# EAGLE design 526_AI_BLOCKS_Rev020003 (EAGLE 9.6.2)
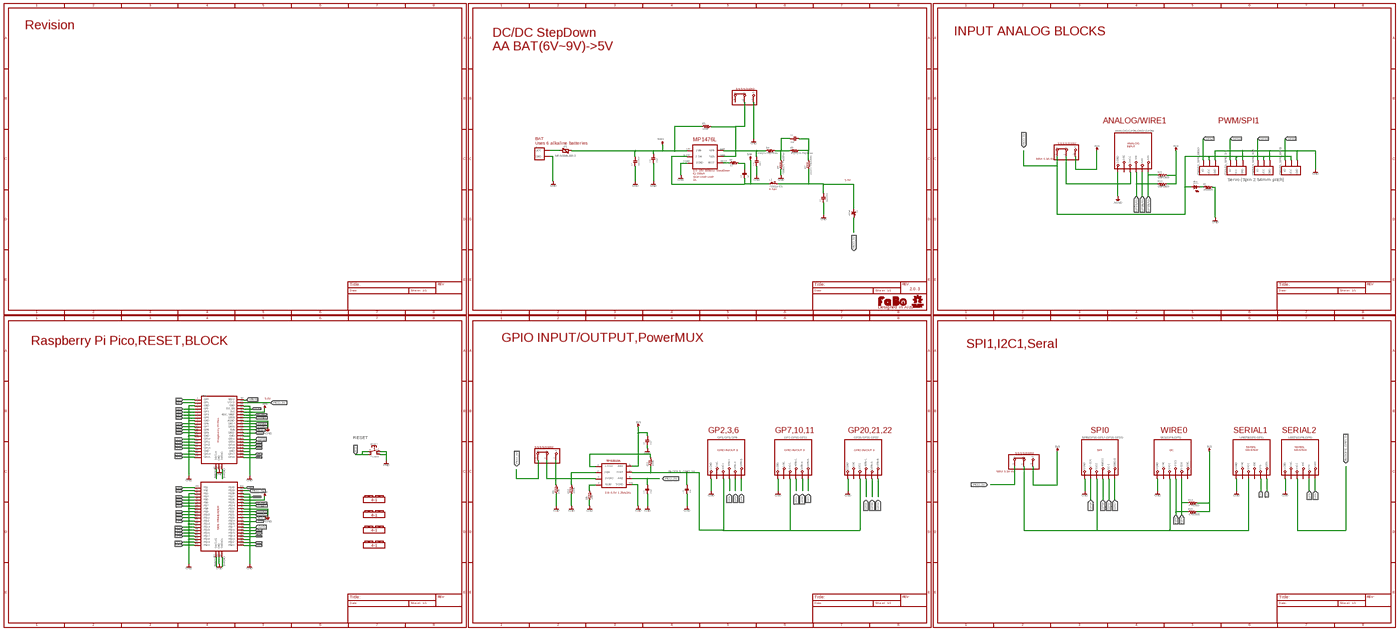
[diagram p0: schematic, sheet 1, overview]
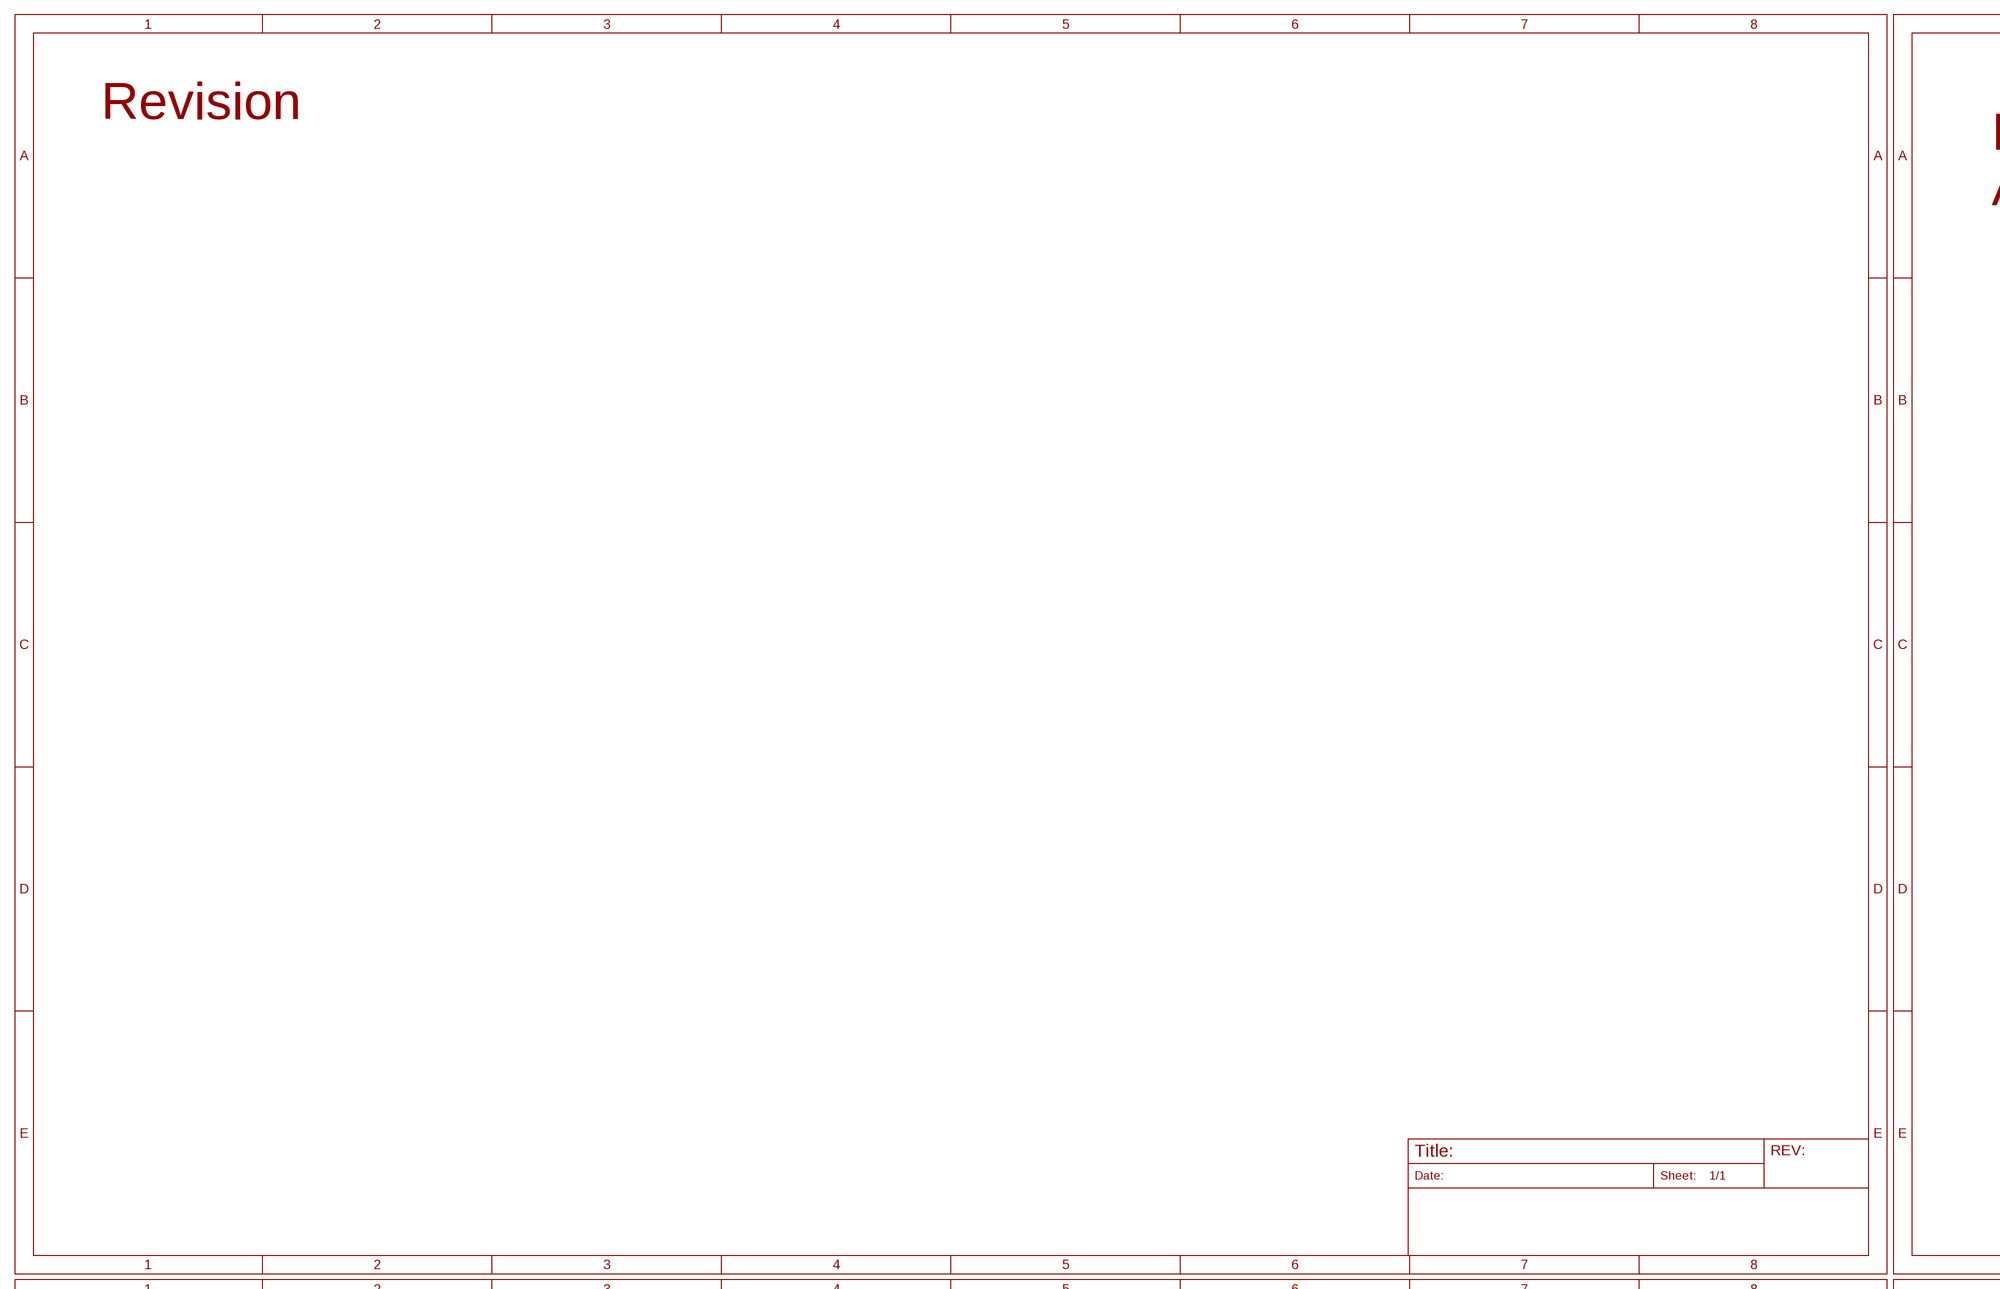
[diagram p1: schematic, sheet 1, part 1 of 6]
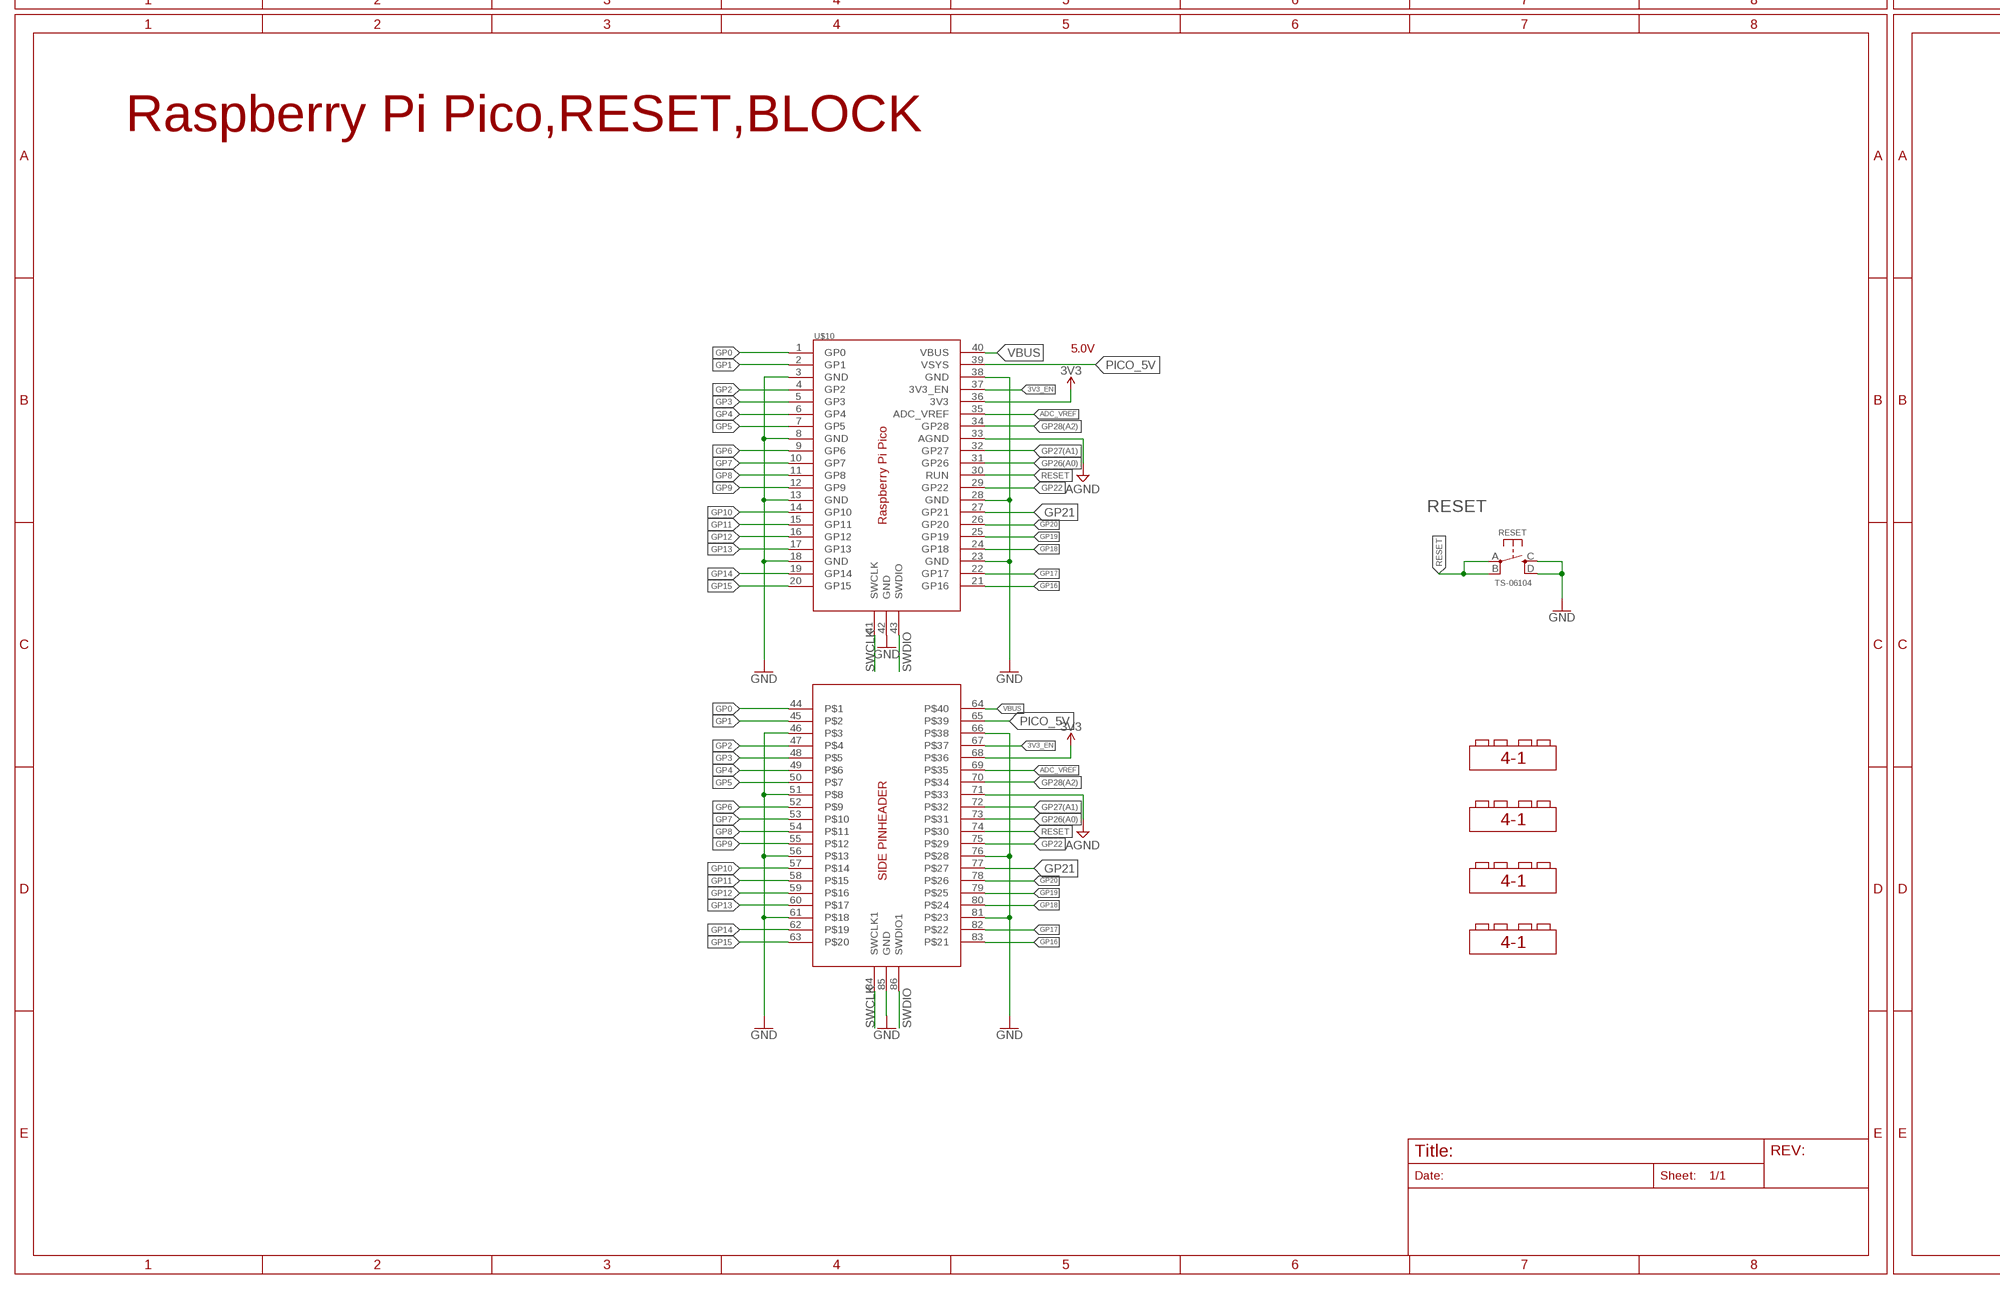
[diagram p2: schematic, sheet 1, part 2 of 6]
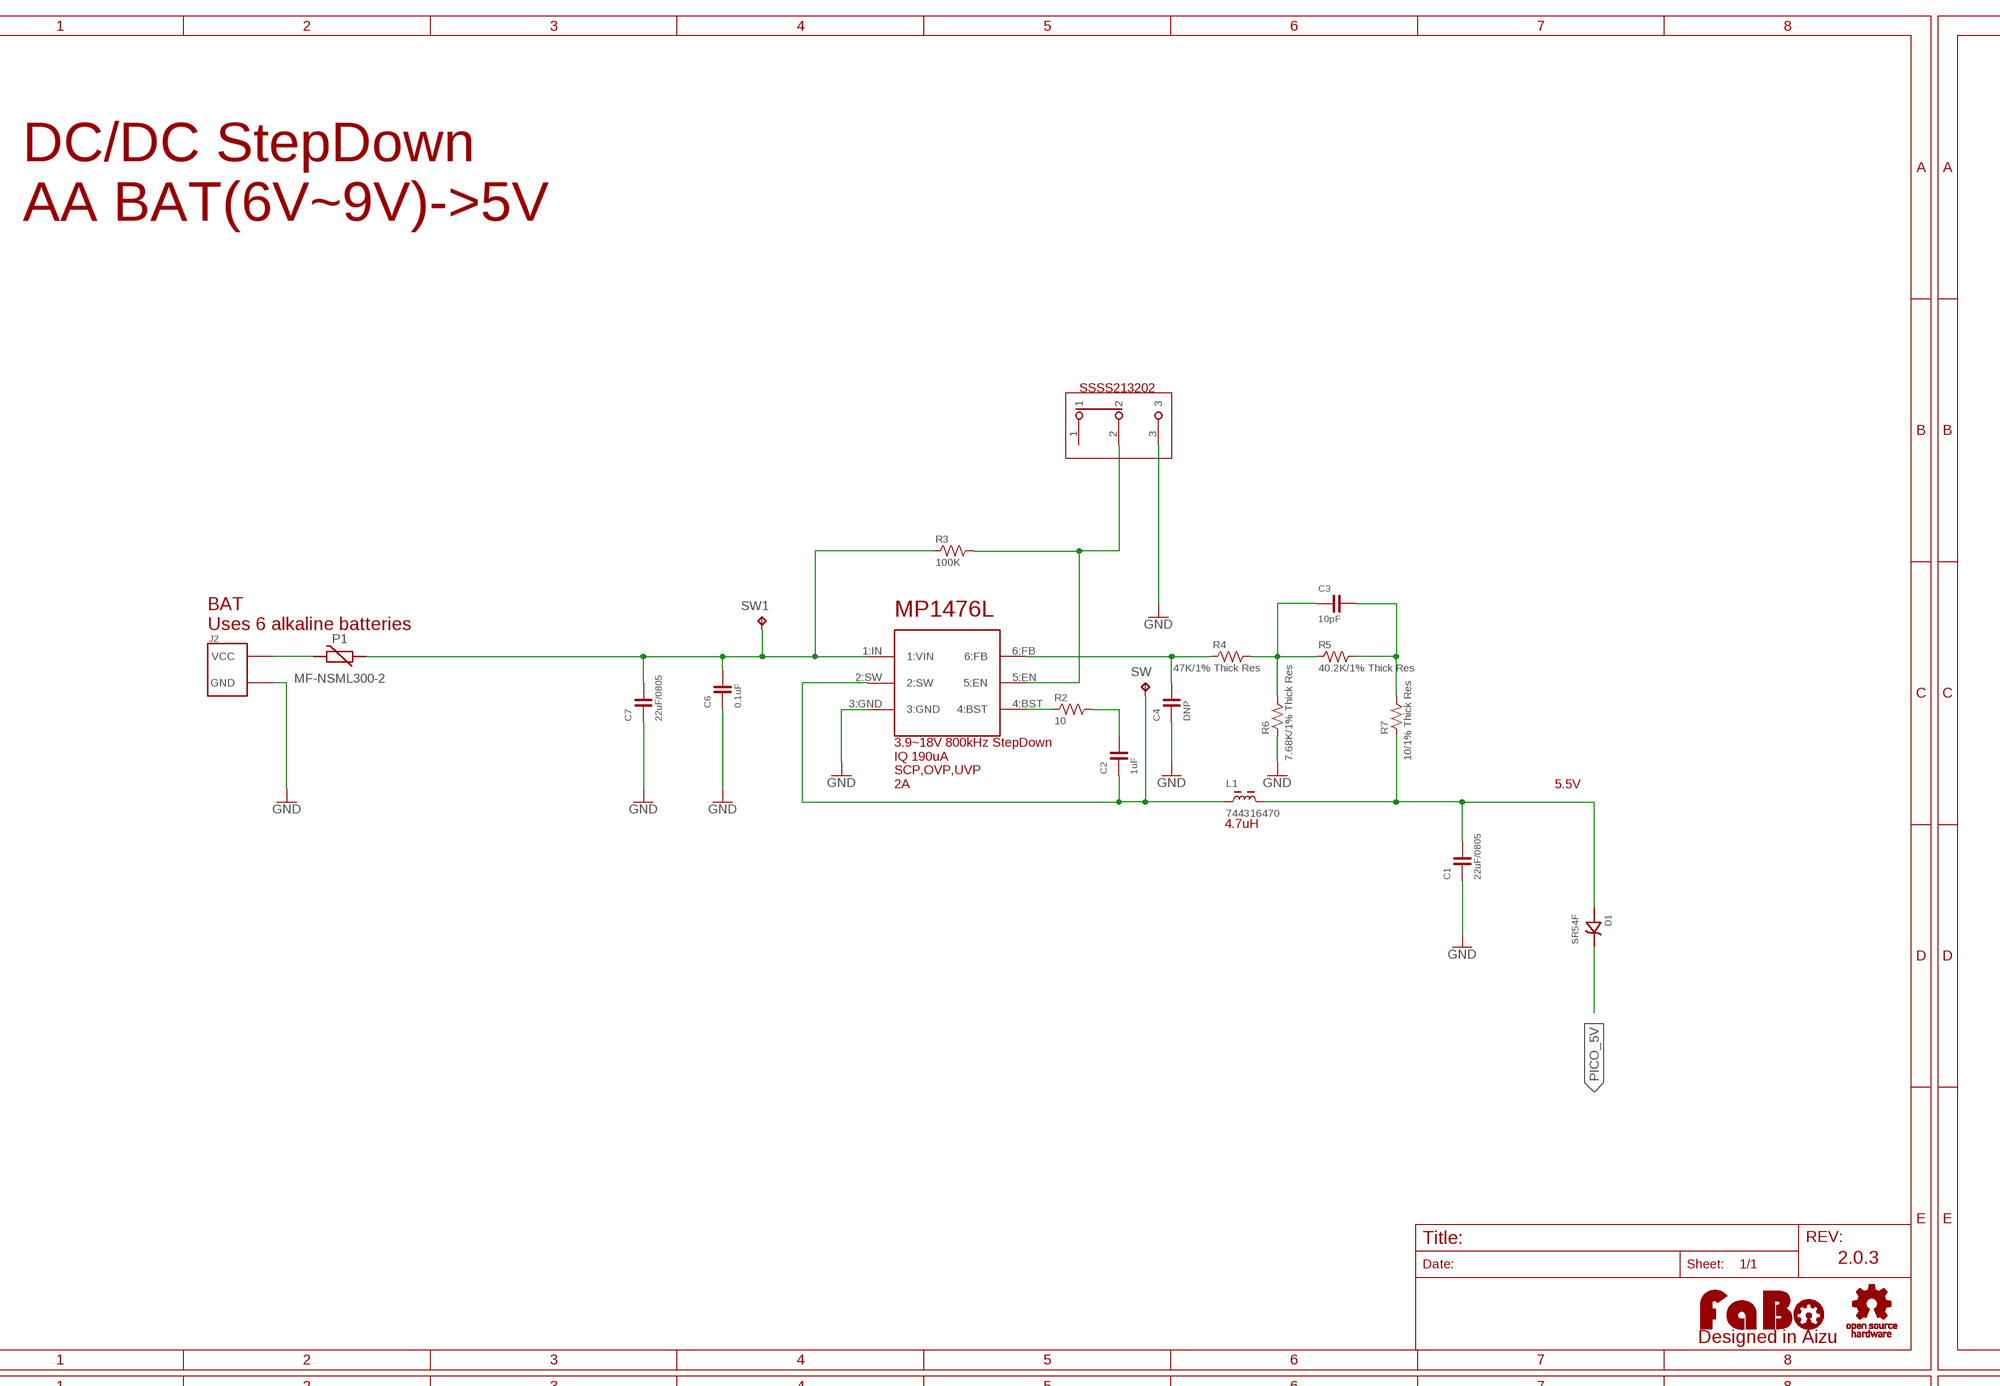
[diagram p3: schematic, sheet 1, part 3 of 6]
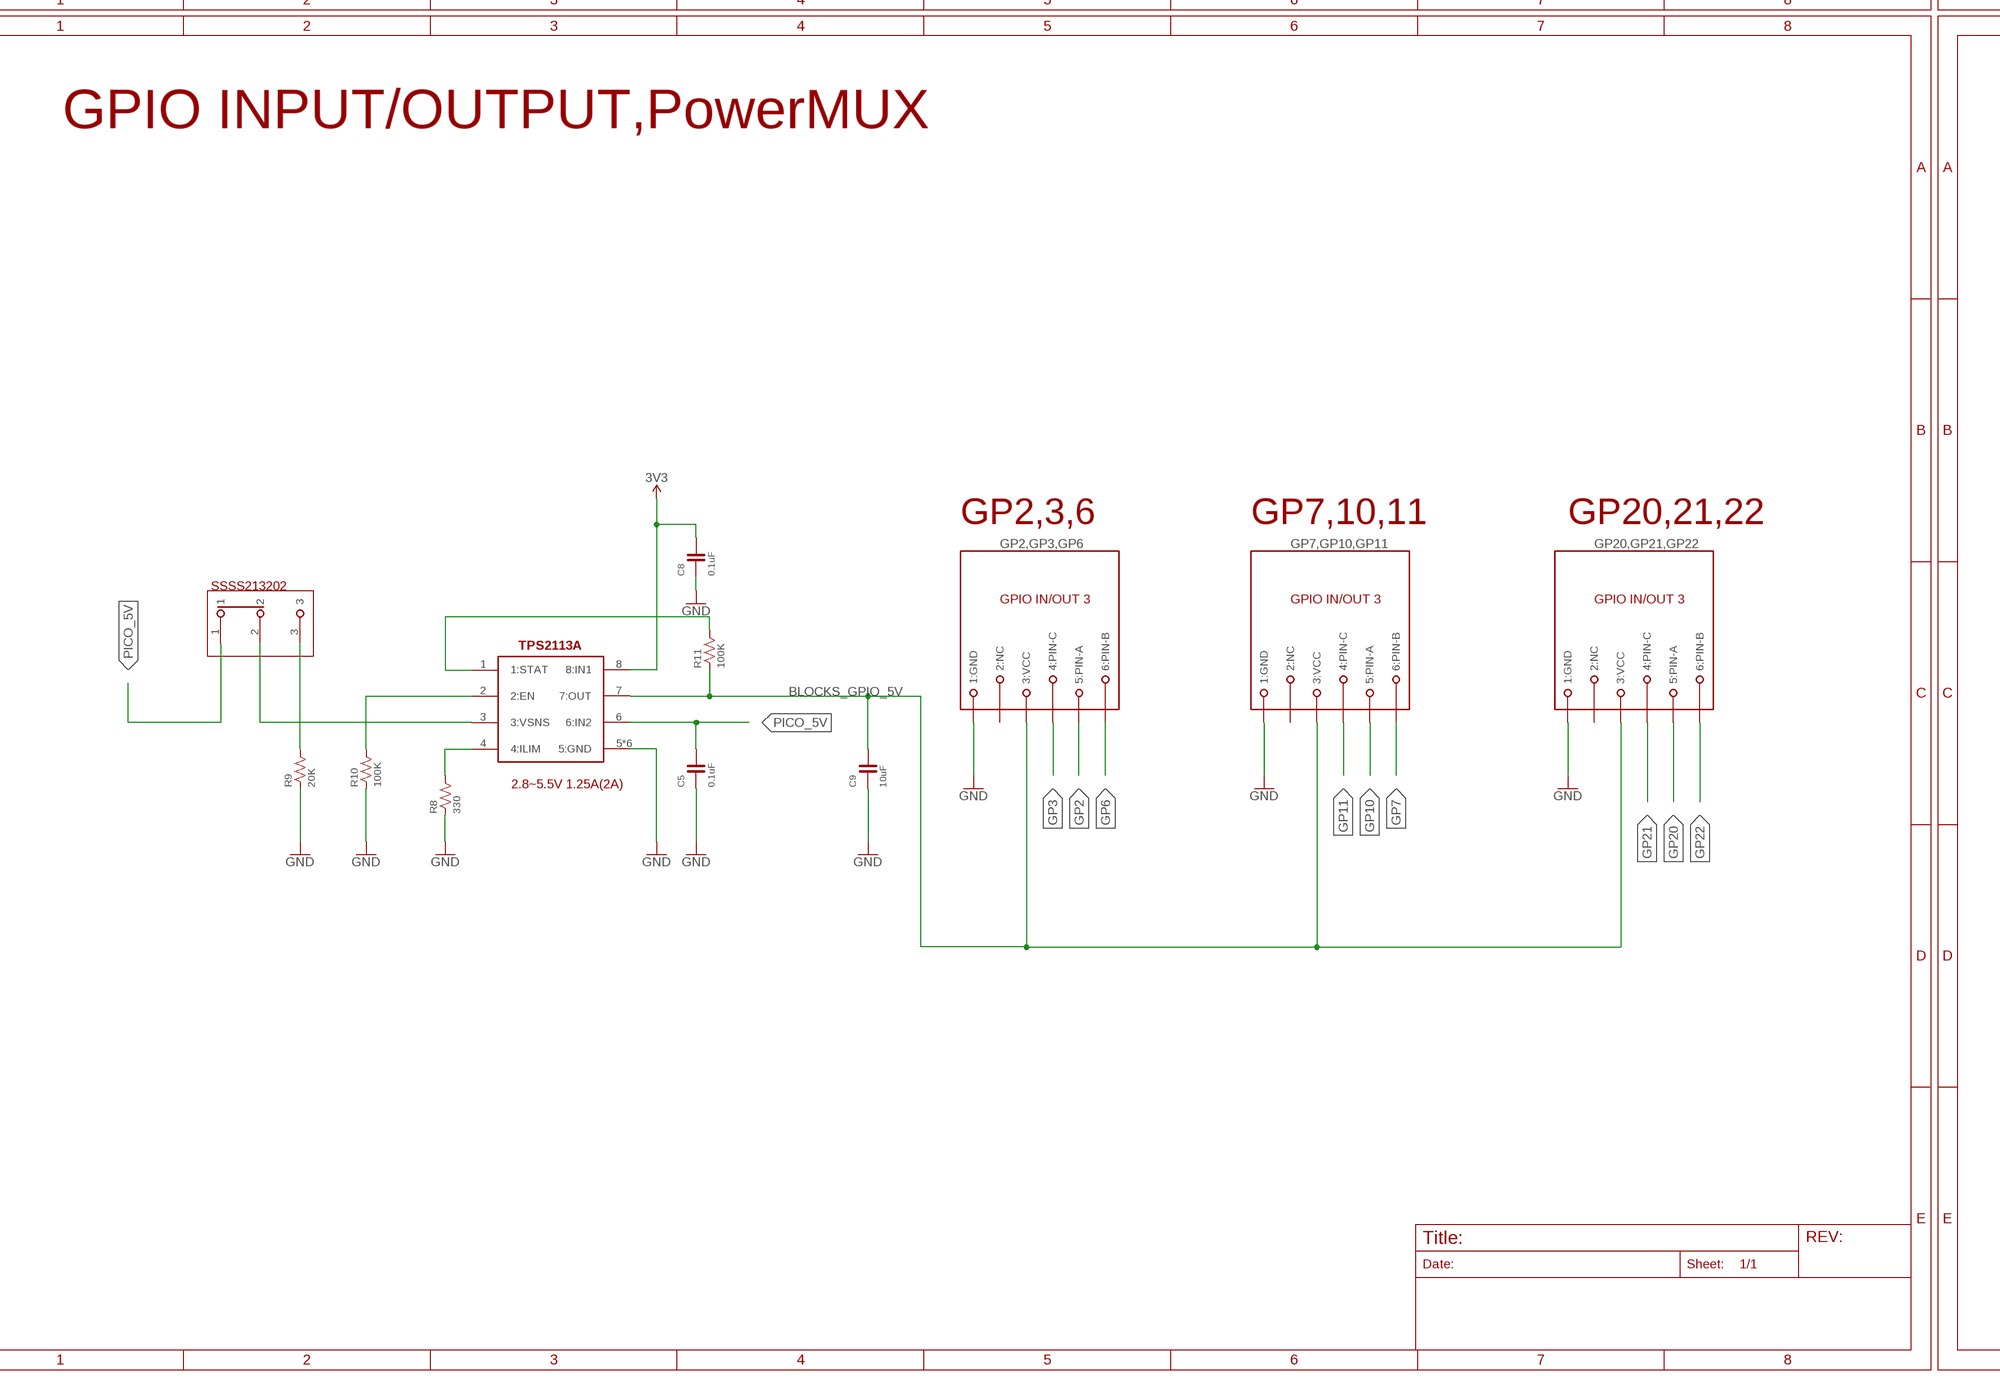
[diagram p4: schematic, sheet 1, part 4 of 6]
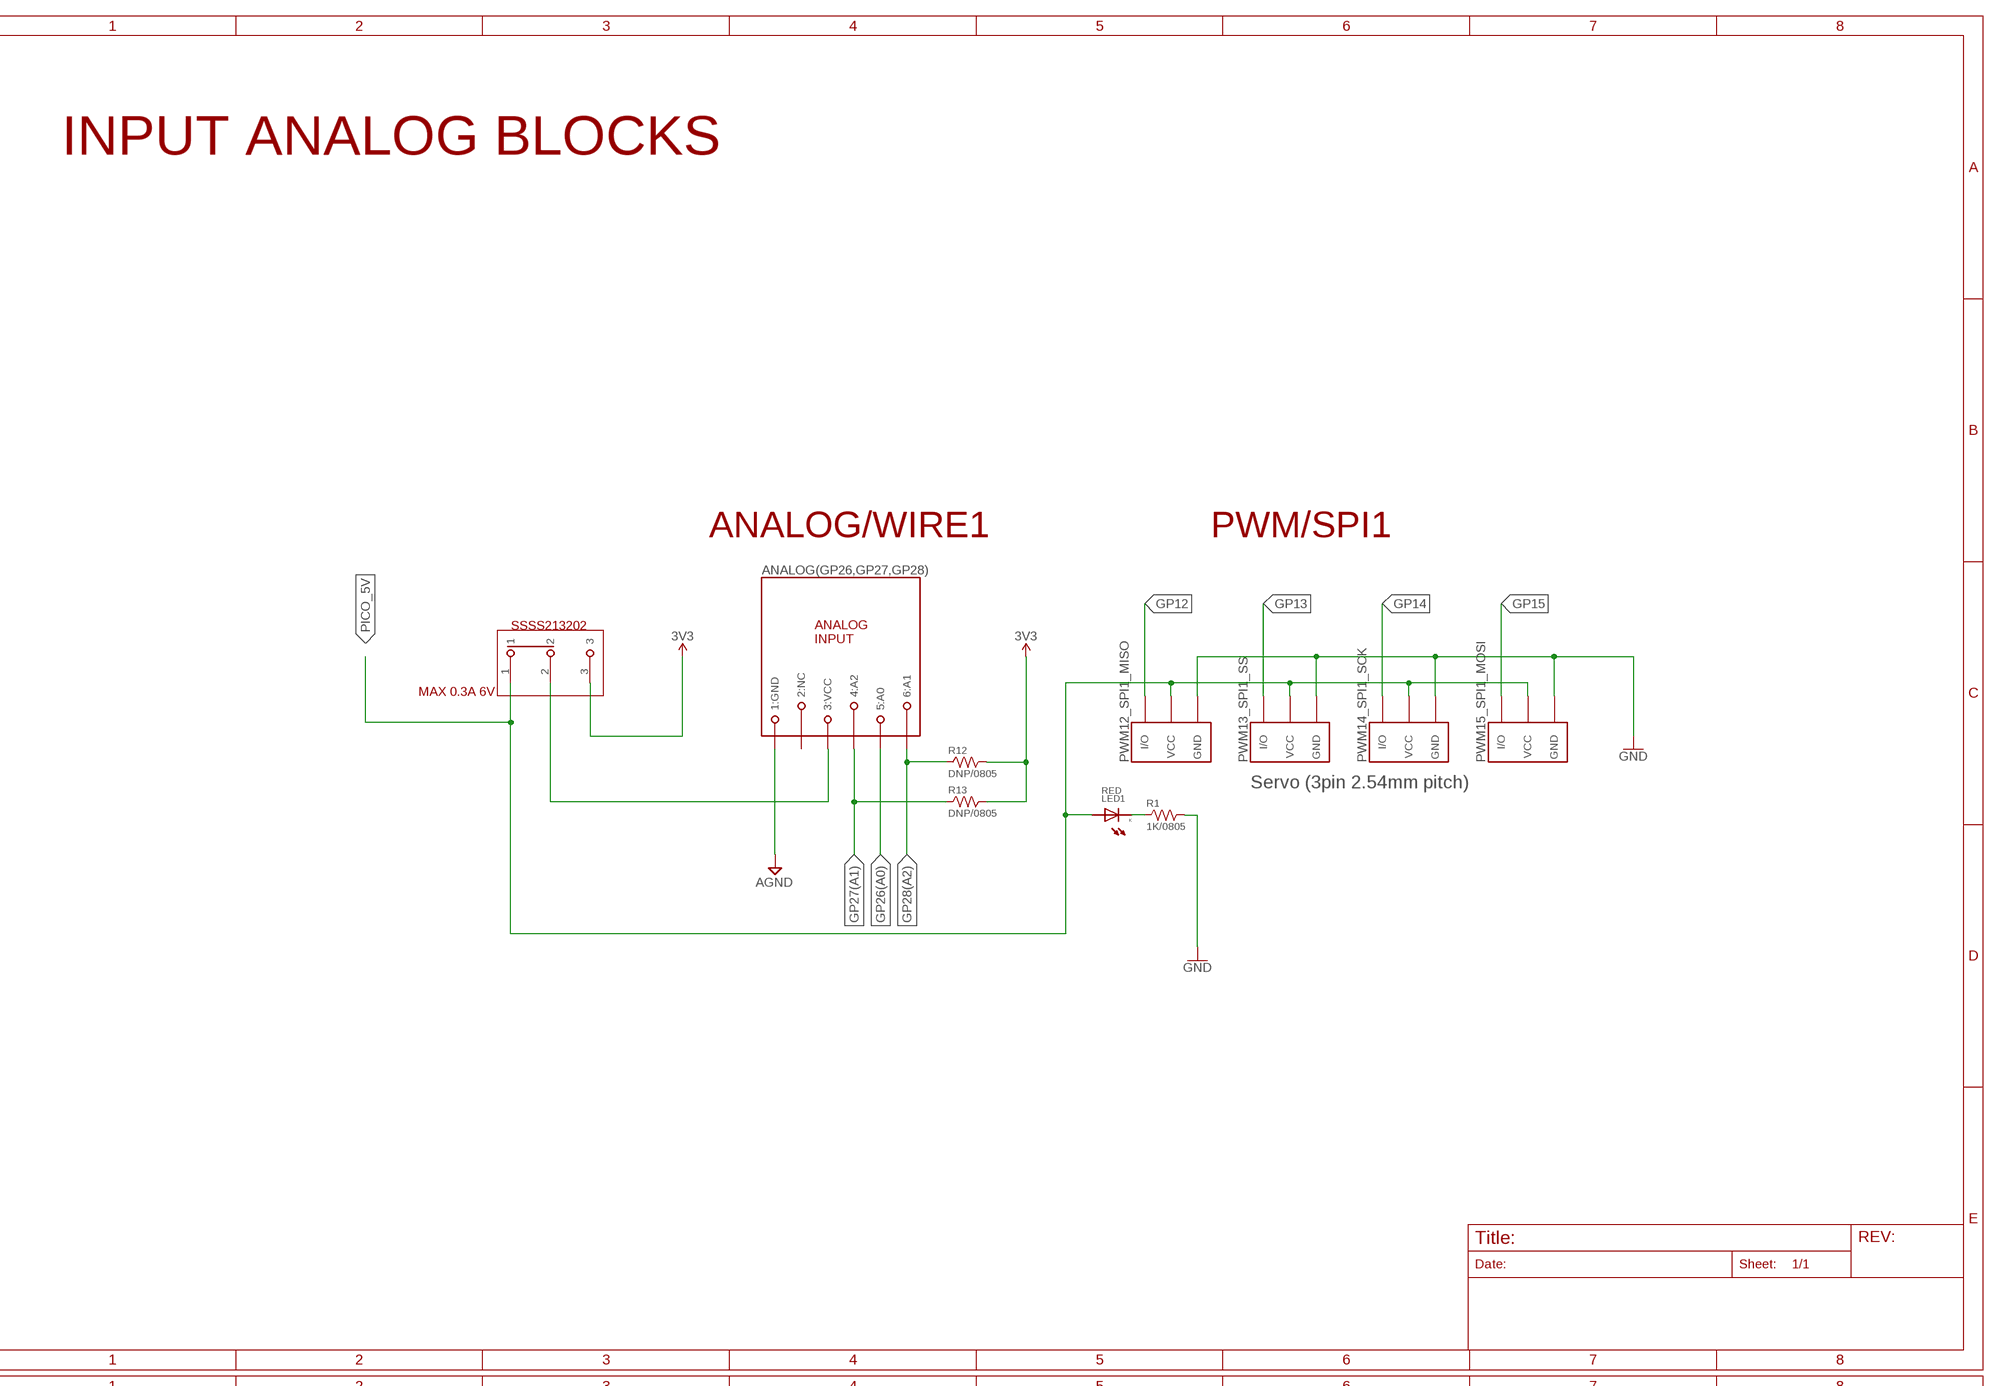
[diagram p5: schematic, sheet 1, part 5 of 6]
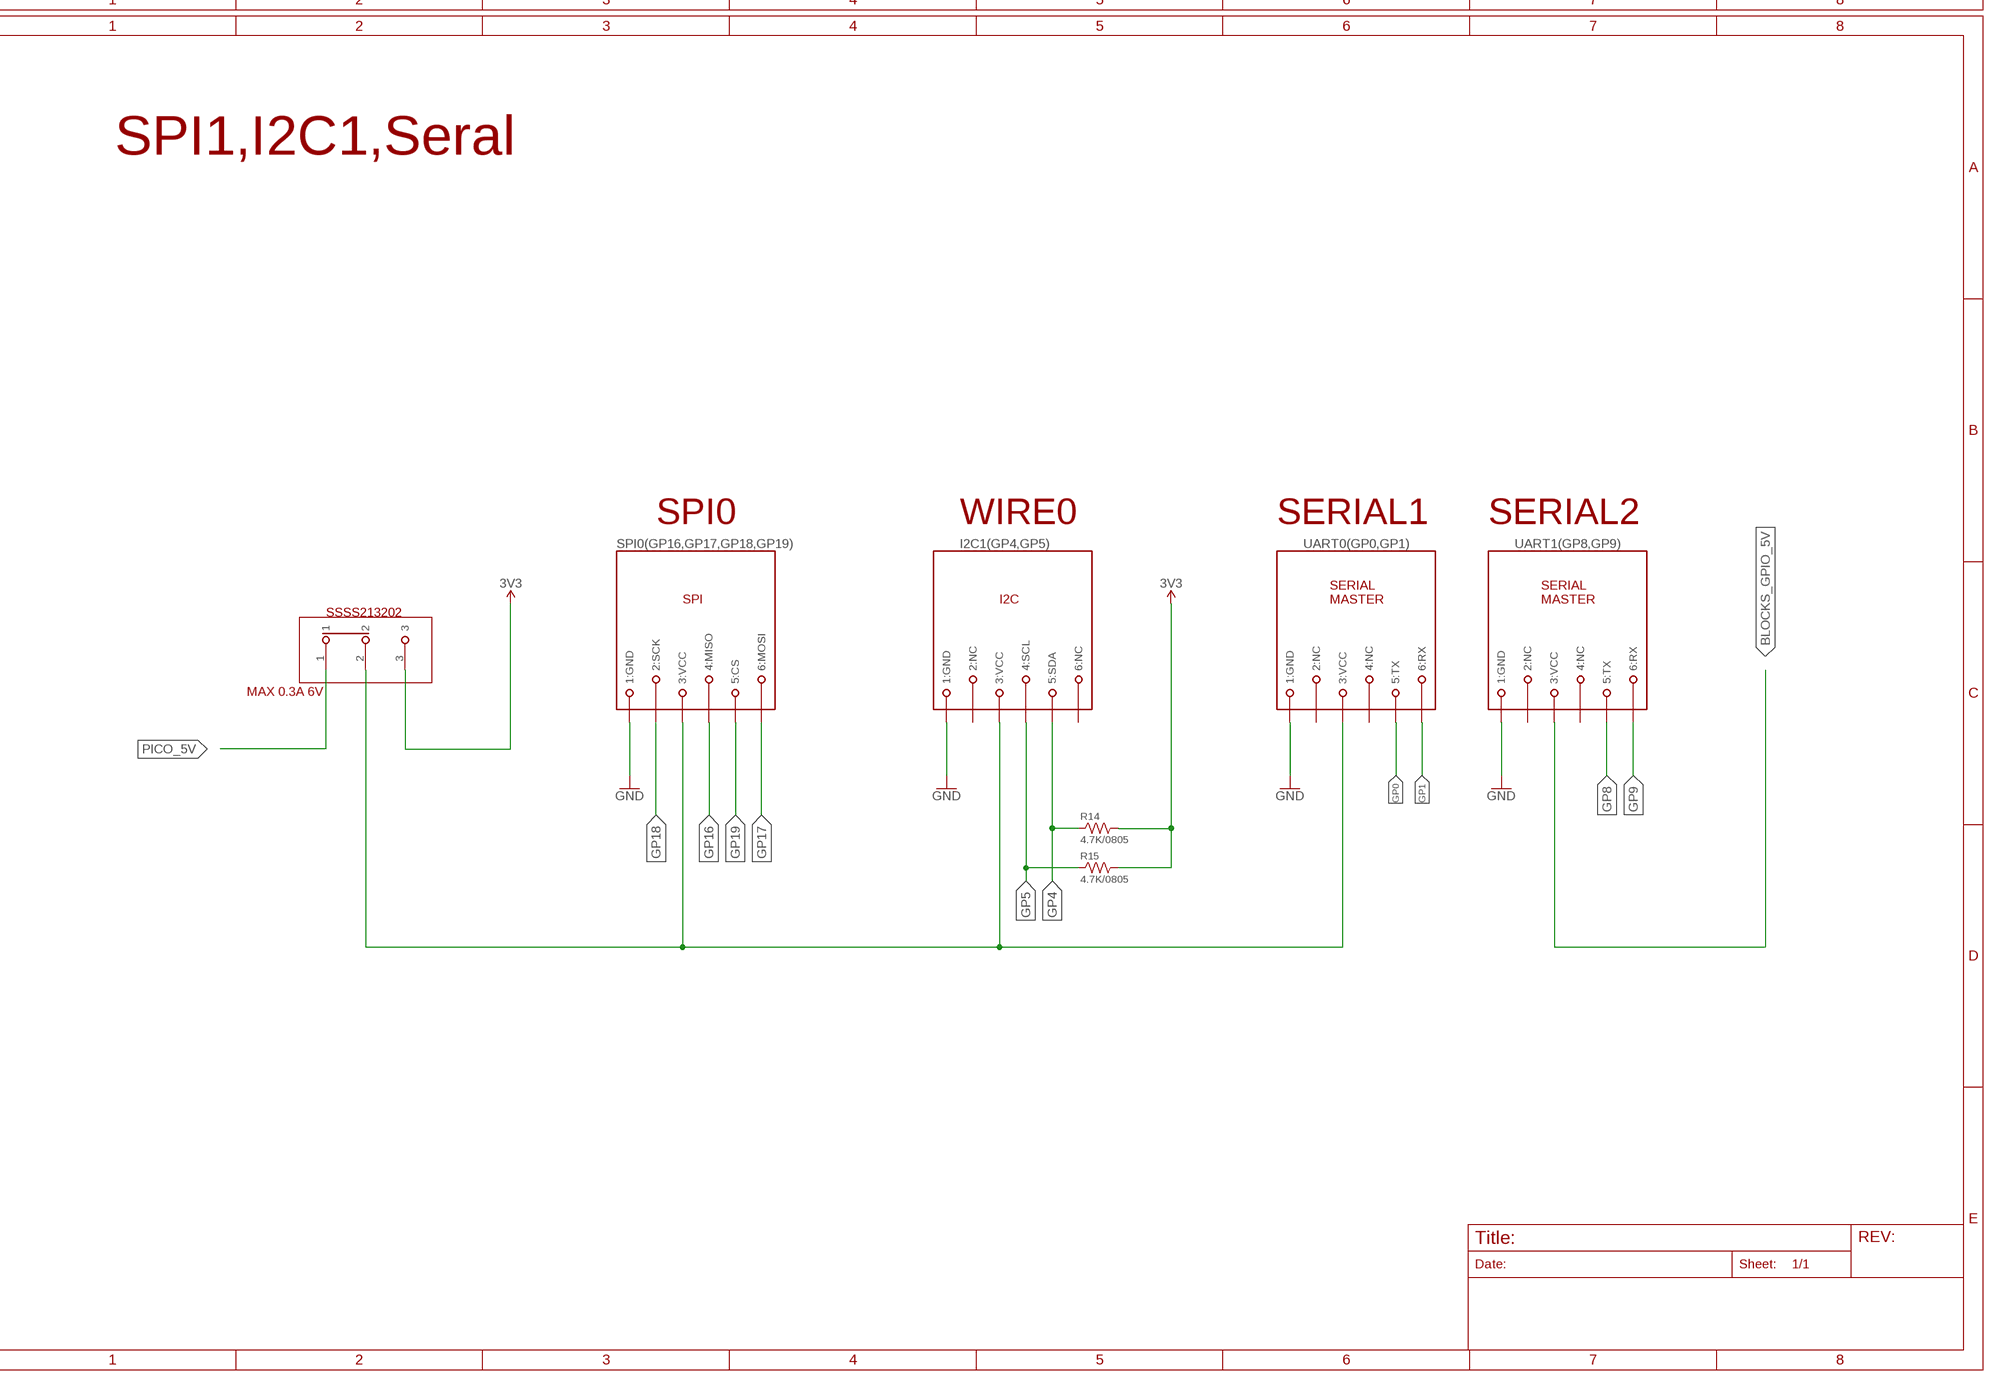
[diagram p6: schematic, sheet 1, part 6 of 6]

## Parts
ANALOG(GP26,GP27,GP28)  MODULAR-JACK-6P-RJ11_ANALOG3  [7002-6PXC-X]
C1  22uF/0805  CAPACITOR-0805  [0805]
C2  1uF  CAPACITOR-0603  [0603]
C3  10pF  CAPACITOR-0603  [0603]
C4  DNP  CAPACITOR-0603  [0603]
C5  0.1uF  CAPACITOR-0603  [0603]
C6  0.1uF  CAPACITOR-0603  [0603]
C7  22uF/0805  CAPACITOR-0805  [0805]
C8  0.1uF  CAPACITOR-0603  [0603]
C9  10uF  CAPACITOR-0603  [0603]
D1  SR54F  [SMBF]
GP2,GP3,GP6  MODULAR-JACK-6P-RJ11_GPIO3  [7002-6PXC-X]
GP7,GP10,GP11  MODULAR-JACK-6P-RJ11_GPIO3  [7002-6PXC-X]
GP20,GP21,GP22  MODULAR-JACK-6P-RJ11_GPIO3  [7002-6PXC-X]
I2C1(GP4,GP5)  MODULAR-JACK-6P-RJ11_I2C  [7002-6PXC-X]
J2  FABO_BRICK_2PIN  [FABO_BRICK_2PIN_B02B-PASK-1_SILK]
L1  744316470  [744316470]
LED1  RED  LED-0603  [0603]
LOGO1  LOGO_OSHW-M_BOTTOM  [LOGO_OSHW_M_BOTTOM]
LOGO2  LOGO_FABO-M  [LOGO_FABO_M]
P1  MF-NSML300-2  POLYSWITCH1206  [1206]
PWM12_SPI1_MISO  FABO_BRICK_3PIN-HEADER  [FABO_BRICK_3PIN_HEADER]
PWM13_SPI1_SS  FABO_BRICK_3PIN-HEADER  [FABO_BRICK_3PIN_HEADER]
PWM14_SPI1_SCK  FABO_BRICK_3PIN-HEADER  [FABO_BRICK_3PIN_HEADER]
PWM15_SPI1_MOSI  FABO_BRICK_3PIN-HEADER  [FABO_BRICK_3PIN_HEADER]
R1  1K/0805  RESISTOR-0805  [0805]
R2  10  RESISTOR-0603  [0603]
R3  100K  RESISTOR-0603  [0603]
R4  47K/1% Thick Res  RESISTOR-0603  [0603]
R5  40.2K/1% Thick Res  RESISTOR-0603  [0603]
R6  7.68K/1% Thick Res  RESISTOR-0603  [0603]
R7  10/1% Thick Res  RESISTOR-0603  [0603]
R8  330  RESISTOR-0603  [0603]
R9  20K  RESISTOR-0603  [0603]
R10  100K  RESISTOR-0603  [0603]
R11  100K  RESISTOR-0603  [0603]
R12  DNP/0805  RESISTOR-0805  [0805]
R13  DNP/0805  RESISTOR-0805  [0805]
R14  4.7K/0805  RESISTOR-0805  [0805]
R15  4.7K/0805  RESISTOR-0805  [0805]
RESET  TS-06104  [TS-06104]
SPI0(GP16,GP17,GP18,GP19)  MODULAR-JACK-6P-RJ11_SPI  [7002-6PXC-X]
SW  TPB1,27  [B1,27]
SW1  TPB1,27  [B1,27]
U2  MP1476L  [SOT563]
U$1  SSSS213202  [SSSS213202]
U$4  BLOCK_4-1  [4-1BLOCK]
U$5  BLOCK_4-1  [4-1BLOCK]
U$6  BLOCK_4-1  [4-1BLOCK]
U$7  BLOCK_4-1  [4-1BLOCK]
U$8  SSSS213202  [SSSS213202]
U$9  SSSS213202  [SSSS213202]
U$10  RASPBERRY_PI_PICO_BOTH_TH_PINHEADER  [RASPBERRY_PI_PICO_HEADER_BOTH]
U$11  SSSS213202  [SSSS213202]
U$17  TPS2113A  [VSON8]
UART0(GP0,GP1)  MODULAR-JACK-6P-RJ11_SERIAL_M  [7002-6PXC-X]
UART1(GP8,GP9)  MODULAR-JACK-6P-RJ11_SERIAL_M  [7002-6PXC-X]

## Nets
3V3: C8.2 R12.2 R13.2 R14.2 R15.2 U$1.3 U$8.3 U$10.36(3V3) U$10.68 U$17.8(8:IN1)
3V3_EN: U$10.37(3V3_EN) U$10.67
ADC_VREF: U$10.35(ADC_VREF) U$10.69
AGND: ANALOG(GP26,GP27,GP28).1(1:GND) U$10.33(AGND) U$10.71
BLOCKS_GPIO_5V: C9.2 GP2,GP3,GP6.3(3:VCC) GP7,GP10,GP11.3(3:VCC) GP20,GP21,GP22.3(3:VCC) R11.1 U$17.7(7:OUT) UART1(GP8,GP9).3(3:VCC)
GND: C1.1 C4.1 C5.1 C6.1 C7.1 C8.1 C9.1 GP2,GP3,GP6.1(1:GND) GP7,GP10,GP11.1(1:GND) GP20,GP21,GP22.1(1:GND) I2C1(GP4,GP5).1(1:GND) J2.GND1(GND) PWM12_SPI1_MISO.GND PWM13_SPI1_SS.GND PWM14_SPI1_SCK.GND PWM15_SPI1_MOSI.GND R1.2 R6.1 R8.1 R9.1 R10.1 RESET.C RESET.D SPI0(GP16,GP17,GP18,GP19).1(1:GND) U2.3:GND U$10.3(GND) U$10.8(GND) U$10.13(GND) U$10.18(GND) U$10.23(GND) U$10.28(GND) U$10.38(GND) U$10.42(GND) U$10.46 U$10.51 U$10.56 U$10.61 U$10.66 U$10.76 U$10.81 U$10.85(GND) U$11.3 U$17.5(5:GND) U$17.9(5:GND) U$17.P$1(5:GND) U$17.P$2(5:GND) U$17.P$3(5:GND) U$17.P$4(5:GND) UART0(GP0,GP1).1(1:GND) UART1(GP8,GP9).1(1:GND)
GP0: U$10.1(GP0) U$10.44 UART0(GP0,GP1).5(5:TX)
GP1: U$10.2(GP1) U$10.45 UART0(GP0,GP1).6(6:RX)
GP2: GP2,GP3,GP6.5(5:PIN-A) U$10.4(GP2) U$10.47
GP3: GP2,GP3,GP6.4(4:PIN-C) U$10.5(GP3) U$10.48
GP4: I2C1(GP4,GP5).5(5:SDA) R14.1 U$10.6(GP4) U$10.49
GP5: I2C1(GP4,GP5).4(4:SCL) R15.1 U$10.7(GP5) U$10.50
GP6: GP2,GP3,GP6.6(6:PIN-B) U$10.9(GP6) U$10.52
GP7: GP7,GP10,GP11.6(6:PIN-B) U$10.10(GP7) U$10.53
GP8: U$10.11(GP8) U$10.54 UART1(GP8,GP9).5(5:TX)
GP9: U$10.12(GP9) U$10.55 UART1(GP8,GP9).6(6:RX)
GP10: GP7,GP10,GP11.5(5:PIN-A) U$10.14(GP10) U$10.57
GP11: GP7,GP10,GP11.4(4:PIN-C) U$10.15(GP11) U$10.58
GP12: PWM12_SPI1_MISO.I/O U$10.16(GP12) U$10.59
GP13: PWM13_SPI1_SS.I/O U$10.17(GP13) U$10.60
GP14: PWM14_SPI1_SCK.I/O U$10.19(GP14) U$10.62
GP15: PWM15_SPI1_MOSI.I/O U$10.20(GP15) U$10.63
GP16: SPI0(GP16,GP17,GP18,GP19).4(4:MISO) U$10.21(GP16) U$10.83
GP17: SPI0(GP16,GP17,GP18,GP19).6(6:MOSI) U$10.22(GP17) U$10.82
GP18: SPI0(GP16,GP17,GP18,GP19).2(2:SCK) U$10.24(GP18) U$10.80
GP19: SPI0(GP16,GP17,GP18,GP19).5(5:CS) U$10.25(GP19) U$10.79
GP20: GP20,GP21,GP22.5(5:PIN-A) U$10.26(GP20) U$10.78
GP21: GP20,GP21,GP22.4(4:PIN-C) U$10.27(GP21) U$10.77
GP22: GP20,GP21,GP22.6(6:PIN-B) U$10.29(GP22) U$10.75
GP26(A0): ANALOG(GP26,GP27,GP28).5(5:A0) U$10.31(GP26) U$10.73
GP27(A1): ANALOG(GP26,GP27,GP28).4(4:A2) R13.1 U$10.32(GP27) U$10.72
GP28(A2): ANALOG(GP26,GP27,GP28).6(6:A1) R12.1 U$10.34(GP28) U$10.70
IN_BAT1: J2.VCC P1.2
IN_BAT2: C6.2 C7.2 P1.1 R3.1 SW1.TP U2.1:IN(1:VIN)
N$1: LED1.CATHODE R1.1
N$2: ANALOG(GP26,GP27,GP28).3(3:VCC) U$1.2
N$3: I2C1(GP4,GP5).3(3:VCC) SPI0(GP16,GP17,GP18,GP19).3(3:VCC) U$8.2 UART0(GP0,GP1).3(3:VCC)
N$4: R8.2 U$17.4(4:ILIM)
N$5: U$9.2 U$17.3(3:VSNS)
N$7: R9.2 U$9.3
N$8: R10.2 U$17.2(2:EN)
N$9: R2.1 U2.4:BST
N$10: C2.2 R2.2
N$11: C4.2 R4.1 U2.6:FB
N$12: R11.2 U$17.1(1:STAT)
N$13: C1.2 D1.ANODE L1.2 R7.1
N$14: C3.1 R4.2 R5.1 R6.2
N$15: C3.2 R5.2 R7.2
PICO_5V: C5.2 D1.CATHODE LED1.ANODE PWM12_SPI1_MISO.VCC PWM13_SPI1_SS.VCC PWM14_SPI1_SCK.VCC PWM15_SPI1_MOSI.VCC U$1.1 U$8.1 U$9.1 U$10.39(VSYS) U$10.65 U$17.6(6:IN2)
POWERON: R3.2 U2.5:EN U$11.2
RESET: RESET.A RESET.B U$10.30(RUN) U$10.74
SW_OUT: C2.1 L1.1 SW.TP U2.2:SW
SWCLK: U$10.41(SWCLK) U$10.84(SWCLK1)
SWDIO: U$10.43(SWDIO) U$10.86(SWDIO1)
VBUS: U$10.40(VBUS) U$10.64
Unconnected: ANALOG(GP26,GP27,GP28).2(2:NC) GP2,GP3,GP6.2(2:NC) GP7,GP10,GP11.2(2:NC) GP20,GP21,GP22.2(2:NC) I2C1(GP4,GP5).2(2:NC) I2C1(GP4,GP5).6(6:NC) U$11.1 UART0(GP0,GP1).2(2:NC) UART0(GP0,GP1).4(4:NC) UART1(GP8,GP9).2(2:NC) UART1(GP8,GP9).4(4:NC)

## Notes on the sheet
- Revision
- INPUT ANALOG BLOCKS
- DC/DC StepDown
  AA BAT(6V~9V)->5V
- SSSS213202
- ANALOG/WIRE1 | PWM/SPI1
- BAT 
  Uses 6 alkaline batteries
- SSSS213202
- MAX 0.3A 6V
- 3.9~18V 800kHz StepDown
  IQ 190uA
  SCP,OVP,UVP
  2A
- 5.5V | Servo (3pin 2.54mm pitch)
- 4.7uH
- 2.0.3
- Raspberry Pi Pico,RESET,BLOCK | GPIO INPUT/OUTPUT,PowerMUX
- SPI1,I2C1,Seral
- 5.0V
- GP2,3,6 | GP7,10,11 | GP20,21,22 | SPI0 | WIRE0 | SERIAL1 | SERIAL2
- RESET
- SSSS213202
- SSSS213202
- MAX 0.3A 6V
- 2.8~5.5V 1.25A(2A)

## Library data of the parts
ANALOG(GP26,GP27,GP28) = FaBo-Connetor:MODULAR-JACK-6P-RJ11_ANALOG3
C1-C9 = FaBo-Capacitor:CAPACITOR: CAPACITOR
D1 = FaBo-Diode:SR54F: SURFACE MOUNT SCHOTTKY BARRIER RECTIFIER 40V Volts 5 Amperes SMBF molded plastic Forwaord Voltage 0.55V DC Reverse Current 0.1mA
GP2,GP3,GP6 GP7,GP10,GP11 GP20,GP21,GP22 = FaBo-Connetor:MODULAR-JACK-6P-RJ11_GPIO3
I2C1(GP4,GP5) = FaBo-Connetor:MODULAR-JACK-6P-RJ11_I2C
J2 = FaBo-Template:FABO_BRICK_2PIN
L1 = FaBo-Coil:744316470
LED1 = FaBo-LED:LED
LOGO1 = FaBo-Logo:LOGO_OSHW
LOGO2 = FaBo-Logo:LOGO_FABO
P1 = FaBo-Supply:POLYSWITCH
PWM12_SPI1_MISO PWM13_SPI1_SS PWM14_SPI1_SCK PWM15_SPI1_MOSI = FaBo-Template:FABO_BRICK_3PIN: FaBo Brick 3pin
R1-R15 = FaBo-Resistors:RESISTOR: RESISTOR
RESET = FaBo-Switch:TS-06104
SPI0(GP16,GP17,GP18,GP19) = FaBo-Connetor:MODULAR-JACK-6P-RJ11_SPI
SW SW1 = testpad:TP: Test pad
U2 = FaBo-Supply:MP1476L
U$1 U$8 U$9 U$11 = FaBo-Switch:SSSS213202
U$4-U$7 = FaBo-Block:BLOCK_4-1
U$10 = FaBo-Boards:RASPBERRY_PI_PICO_BOTH_TH_PINHEADER
U$17 = FaBo-Switch:TPS2113A; SPICEPREFIX: X
UART0(GP0,GP1) UART1(GP8,GP9) = FaBo-Connetor:MODULAR-JACK-6P-RJ11_SERIAL_M

## Board
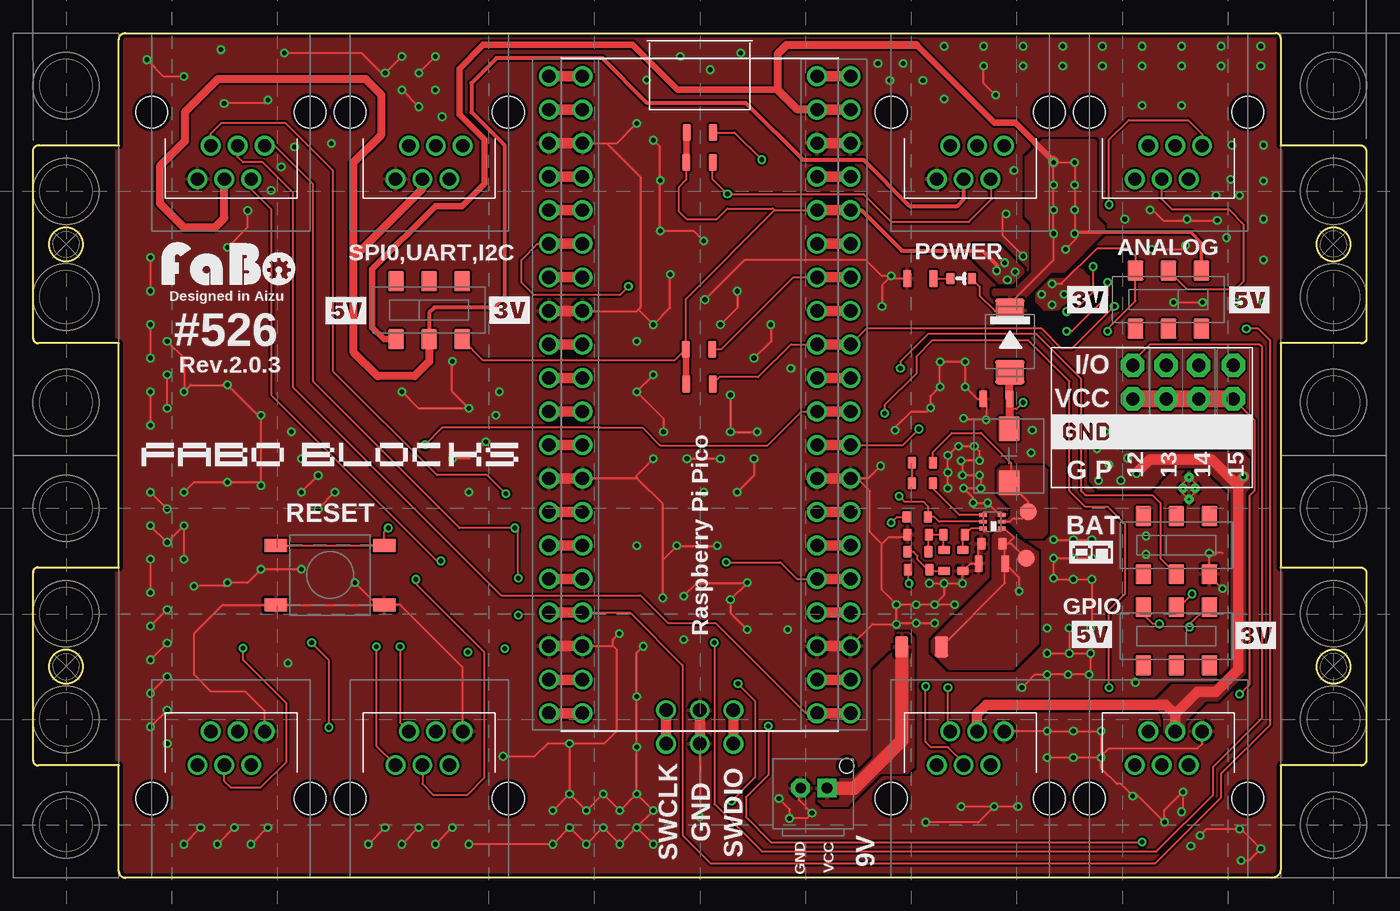
[diagram p7: board, top side]
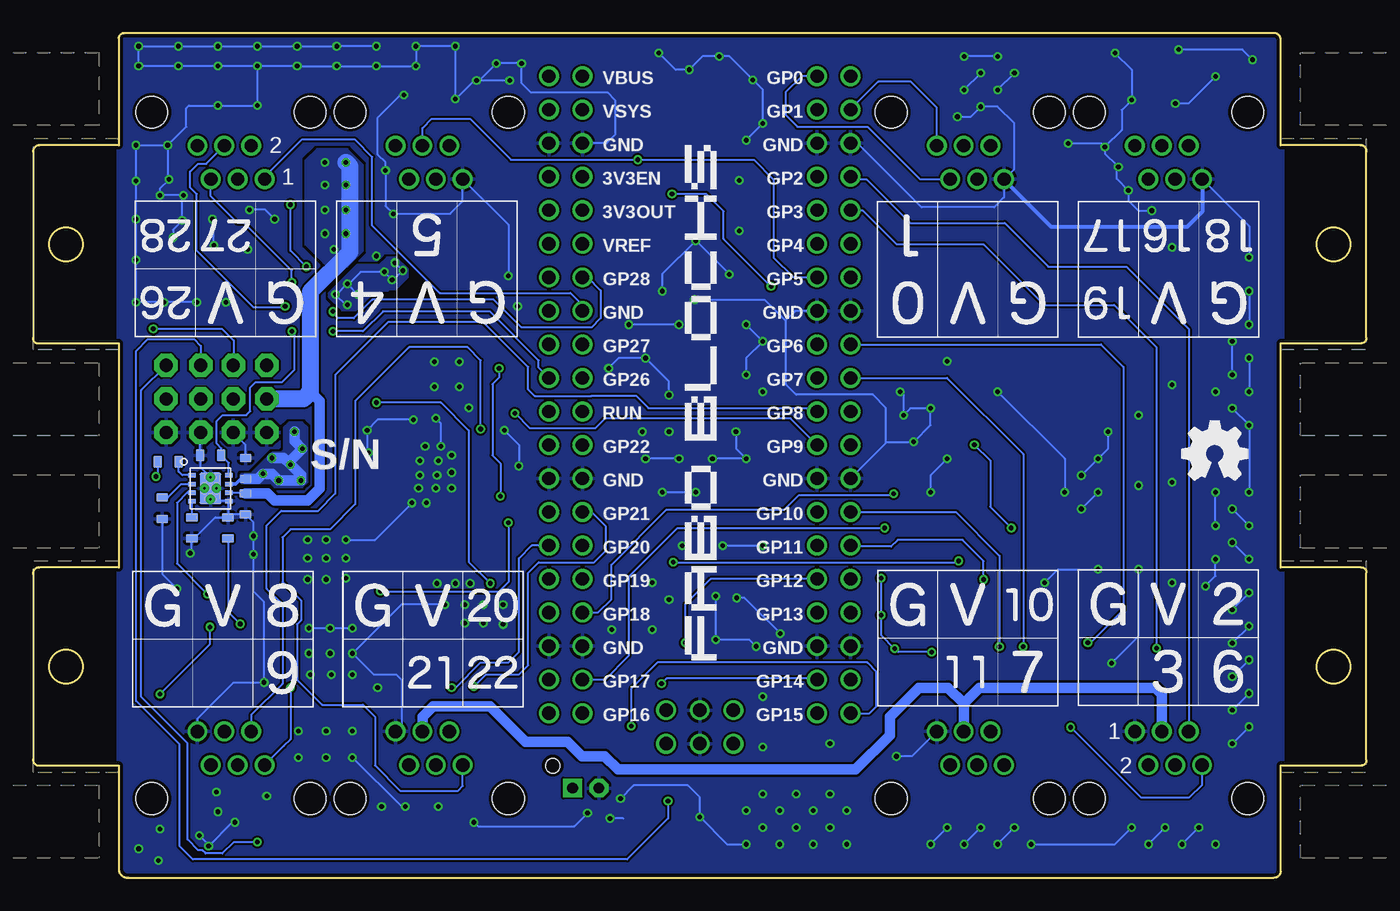
[diagram p8: board, bottom side, seen from below]

Size 101.01 x 64 mm. Coordinates in mm from the lower left corner, seen from the top.
Outline: 0.5,55.5 6.5,55.5 6.5,63.5 arc-90 7,64 94.1,64 arc-90 94.5,63.6 94.5,55.5 100.5,55.5 arc-90 101,55 101,40.9 arc-106 100.6,40.5 94.5,40.5 94.5,23.5 100.5,23.5 arc-103 101,23 101,9 arc-90 100.6,8.5 94.5,8.5 94.5,0.6 arc-90 93.8,0 7,0 arc-90 6.5,0.5 6.5,8.5 0.4,8.5 arc-90 0,8.9 0,23.1 arc-106 0.4,23.5 6.5,23.5 6.5,40.5 0.4,40.5 arc-90 0,40.9 0,55 arc-103 0.5,55.5
Copper layers (1*16): Top 0.035mm / dielectric 1.6mm / Bottom 0.035mm
Design rules "PCBway": minimum track width 6mil, minimum drill 12mil, track to track 6mil, track to pad 6mil, pad to pad 6mil, via to via 6mil, smd to smd 6mil, copper to edge 10mil, drill to drill 10mil, minimum pad ring 10mil, minimum via ring 6mil, stop-mask expansion 2mil, vias tented up to drill 100mil, thermal gap 8mil
tRestrict: area 94.7,7.5 to 103.2,56.7; area -2.3,7.2 to 6.2,56.4
bRestrict: area 94.7,7.5 to 103.2,56.7; area -2.3,7.2 to 6.2,56.4
Milling: area 1.2,46.7 to 3.8,49.3; area 1.2,14.7 to 3.8,17.3; area 97.2,14.7 to 99.8,17.3; area 97.2,46.7 to 99.8,49.3

### Footprints (pad centres in the part's own frame; a part is rotated, then mirrored left to right if it is on the bottom)
7002-6PXC-X = drill 1: 1 2.55,5.08; 2 1.53,2.54; 3 0.51,5.08; 4 -0.51,2.54; 5 -1.53,5.08; 6 -2.55,2.54 | hole 2.4: -6,0; 6,0
0805 = smd 0.6 x 1.3: 1 -1,0; 2 1,0
0603 = smd 0.65 x 0.9: 1 -0.8,0; 2 0.8,0
SMBF = smd 1.85 x 2.2: ANODE 2.325,0; CATHODE -2.325,0
FABO_BRICK_2PIN_B02B-PASK-1_SILK = drill 0.8 pad 1.422 octagon: GND1 -0.953,0 | drill 0.8 pad 1.422 square: VCC 1.048,0 | hole 1.1: 2.547,1.7
744316470 = smd 1.6 x 1.9: 1 0,-2.05; 2 0,2.05
0603' = smd 0.65 x 0.9: ANODE -0.8,0; CATHODE 0.8,0
1206 = smd 1 x 1.6: 1 -1.5,0; 2 1.5,0
FABO_BRICK_3PIN_HEADER = drill 1 pad 1.778 octagon: GND -2.54,0; I/O 2.54,0; VCC 0,0
TS-06104 = smd 1.8 x 1: A 4.1,2.25; B -4.1,2.25; C 4.1,-2.25; D -4.1,-2.25
B1,27 = smd 1.27 x 1.27: TP 0,0
SOT563 = smd 0.25 x 0.6: 1:IN -0.5,-0.7; 2:SW 0,-0.7; 3:GND 0.5,-0.7; 4:BST 0.5,0.7; 5:EN 0,0.7; 6:FB -0.5,0.7
SSSS213202 = smd 1.2 x 1.5: 1 -2.5,-2.2; 2 0,-2.2; 3 2.5,-2.2; 4 2.5,2.2; 5 0,2.2; 6 -2.5,2.2
RASPBERRY_PI_PICO_HEADER_BOTH = drill 1: 1 -8.89,24.13; 2 -8.89,21.59; 3 -8.89,19.05; 4 -8.89,16.51; 5 -8.89,13.97; 6 -8.89,11.43; 7 -8.89,8.89; 8 -8.89,6.35; 9 -8.89,3.81; 10 -8.89,1.27; 11 -8.89,-1.27; 12 -8.89,-3.81; 13 -8.89,-6.35; 14 -8.89,-8.89; 15 -8.89,-11.43; 16 -8.89,-13.97; 17 -8.89,-16.51; 18 -8.89,-19.05; 19 -8.89,-21.59; 20 -8.89,-24.13; 21 8.89,-24.13; 22 8.89,-21.59; 23 8.89,-19.05; 24 8.89,-16.51; 25 8.89,-13.97; 26 8.89,-11.43; 27 8.89,-8.89; 28 8.89,-6.35; 29 8.89,-3.81; 30 8.89,-1.27; 31 8.89,1.27; 32 8.89,3.81; 33 8.89,6.35; 34 8.89,8.89; 35 8.89,11.43; 36 8.89,13.97; 37 8.89,16.51; 38 8.89,19.05; 39 8.89,21.59; 40 8.89,24.13; 41 -2.54,-23.9; 42 0,-23.9; 43 2.54,-23.9; 44 -11.43,24.13; 45 -11.43,21.59; 46 -11.43,19.05; 47 -11.43,16.51; 48 -11.43,13.97; 49 -11.43,11.43; 50 -11.43,8.89; 51 -11.43,6.35; 52 -11.43,3.81; 53 -11.43,1.27; 54 -11.43,-1.27; 55 -11.43,-3.81; 56 -11.43,-6.35; 57 -11.43,-8.89; 58 -11.43,-11.43; 59 -11.43,-13.97; 60 -11.43,-16.51; 61 -11.43,-19.05; 62 -11.43,-21.59; 63 -11.43,-24.13; 64 11.43,24.13; 65 11.43,21.59; 66 11.43,19.05; 67 11.43,16.51; 68 11.43,13.97; 69 11.43,11.43; 70 11.43,8.89; 71 11.43,6.35; 72 11.43,3.81; 73 11.43,1.27; 74 11.43,-1.27; 75 11.43,-3.81; 76 11.43,-6.35; 77 11.43,-8.89; 78 11.43,-11.43; 79 11.43,-13.97; 80 11.43,-16.51; 81 11.43,-19.05; 82 11.43,-21.59; 83 11.43,-24.13; 84 -2.54,-26.44; 85 0,-26.44; 86 2.54,-26.44
VSON8 = smd 0.6 x 0.3: 1 -1.4,0.975; 2 -1.4,0.325; 3 -1.4,-0.325; 4 -1.4,-0.975; 5 1.4,-0.975; 6 1.4,-0.325; 7 1.4,0.325; 8 1.4,0.975 | smd 1.65 x 2.4: 9 0,0 | drill 0.2: P$1 0,0.83; P$2 0,-0.83; P$3 -0.455,0; P$4 0.455,0

### Placement (x,y rotation side)
ANALOG(GP26,GP27,GP28)  86,58 180 top
C1  72.97,36.28 0 top
C2  67.37,31.44 180 top
C3  67.04,24.7 180 top
C4  70.44,24.05 90 top
C5  84.91,28.32 90 bottom
C6  72.63,25.3 0 top
C7  72.63,23.8 0 top
C8  87.54,32.01 0 bottom
C9  84.9,31.02 270 bottom
D1  74,40.64 270 top
GP2,GP3,GP6  15,6 0 top
GP7,GP10,GP11  30,6 0 top
GP20,GP21,GP22  71,6 0 top
I2C1(GP4,GP5)  71,58 180 top
J2  59.09,6.79 0 top
L1  73.93,31.96 0 top
LED1  RED  [0603']  70.3,45.4 180 top
LOGO1  11.48,32.13 0 top
LOGO2  14.81,44.53 0 top
P1  67.3,17.5 180 top
PWM12_SPI1_MISO  83.3,36.28 90 top
PWM13_SPI1_SS  85.84,36.28 90 top
PWM14_SPI1_SCK  88.3,36.28 90 top
PWM15_SPI1_MOSI  90.92,36.28 90 top
R1  67.2,45.4 180 top
R2  67.37,29.89 180 top
R3  66.97,27.34 0 top
R4  69.77,25.99 180 top
R5  69.01,24.04 270 top
R6  67.05,26 0 top
R7  67.08,23.35 0 top
R8  88.98,26.51 90 bottom
R9  86.24,26.5 270 bottom
R10  91.22,28 90 bottom
R11  90.78,31.51 0 bottom
R12  50.45,40.04 180 top
R13  50.48,37.42 180 top
R14  50.48,54.19 180 top
R15  50.51,56.47 180 top
RESET  22.5,22.93 0 top
SPI0(GP16,GP17,GP18,GP19)  15,58 180 top
SW  75.38,27.73 0 top
SW1  75.21,24.21 0 top
U2  72.66,26.98 90 top
U$1  86,43.8 180 top
U$4  98.5,48 180 top
U$5  98.5,16 180 top
U$6  2.5,48 0 top
U$7  2.5,16 0 top
U$8  30,43 0 top
U$9  86.6,18.3 180 top
U$10  50.5,36.6 0 top
U$11  86.6,25.2 0 top
U$17  87.57,29.51 0 bottom
U$19  [LOGO_SILK_GND]  77.86,32.54 0 top
UART0(GP0,GP1)  30,58 180 top
UART1(GP8,GP9)  86,6 0 top

### Tracks (layer width: path | path; a pad name or v marks a point on that pad's centre or on a via)
3V3  (via drill 0.35)
  Top 0.152: 62,50.57 U$10.68 | v77.2,45 77.9,45 80.6,47.7 82.9,47.7 83.5,47.1 U$1.3 83.5,43.7 81.4,41.6 v81.4,41.4 | 49.48,56.44 R15.2 | R14.2 49.48,52.88 48.9,52.3 48.9,50.5 49.5,49.9 51.8,49.9 52.6,50.7 56.04,50.7 56.17,50.57 | 49.45,37.45 R13.2 | 56.17,50.57 49.45,43.85 R12.2 48.61,39.2 34.1,39.2 U$8.3 | 56.17,50.57 U$10.36
  Top 0.305: U$10.68 62.73,50.57 65.8,47.5 71.9,47.5 73,46.4 v73,46
  Top 0.508: R15.2 49.51,54.22 R14.2 | R12.2 49.45,37.45
  Top 0.813: U$10.36 62,50.57
  Bottom 0.152: 77.15,44.95 76.2,45.9 v74.4,45.9 v73.8,45.3 73.7,45.3 v73,46 v73.6,46.6 | 77.15,44.95 v77.2,45 78,44.2 v78.1,44.2 77.3,43.4 v77.2,43.4 | v76.4,44.2 77.15,44.95 | U$17.8 86.17,31.43 C8.2 86.74,32.54 87.1,32.9 87.1,34.6 86.65,35.05 84.85,35.05 84.55,35.35 84.55,37.15 84.15,37.55 82.15,37.55 81.2,38.5 81.2,41.2 v81.4,41.4
  pour Bottom (no thermals): 72.6,46.1 73.5,47 74.2,47 74.8,46.4 76.5,46.4 78.6,44.3 78.6,44 77.6,43 76.5,43 75,44.5 74.1,44.5 74,44.6 73.5,44.6 72.6,45.5
  pour Top (no thermals): 72.5,45.7 71.7,46.5 71.1,47.1 71,47.1 71,47.7 71.3,48 73,48 73.1,48 74.2,46.9 75,46.1 75,45.8 74.2,45 73.2,45
  pour Top (no thermals): 76,43.8 76,44.3 77.1,45.4 78.2,45.4 78.3,45.5 78.9,46.1 79.4,46.1 79.6,45.9 80,45.5 80,44.9 80,44.6 79,43.6 78.3,43.6 77.8,43.1 77.7,43.1 77.6,43 76.6,43 76,43.6
3V3_EN
  Top 0.813: U$10.37 U$10.67
ADC_VREF
  Top 0.813: U$10.35 U$10.69
AGND
  Top 0.813: U$10.71 U$10.33
  Bottom 0.152: ANALOG(GP26,GP27,GP28).1 83.45,53.12 80.67,55.9 76.6,55.9 75.3,54.6 75.3,49.4 70.2,44.3 60.3,44.3 59.39,43.39 U$10.33
BLOCKS_GPIO_5V  (via drill 0.35)
  Top 0.152: 83.6,30.7 v83.6,30.6
  Top 0.813: 83.6,30.7 84.6,31.7 89.3,31.7 91,30 | 86.51,12.41 88.2,14.1 89.6,14.1 91.3,15.8 91.3,29.7 91,30 | v91.7,30.4 91.3,30 91,30 | UART1(GP8,GP9).3 86.51,12.41 | GP20,GP21,GP22.3 71.51,12.41 72.2,13.1 85.82,13.1 86.51,12.41
  Bottom 0.152: R11.1 91.58,30.53 v91.7,30.4
  Bottom 0.254: U$17.7 85.67,29.83 85.29,30.21 C9.2
  Bottom 0.813: C9.2 83.99,30.21 v83.6,30.6 82.9,30.6 v82.4,30.1 v80.7,30.1 80.7,30.5 v81.5,31.3 | v81.5,31.3 81.5,31.6 v80.6,32.5 81.2,33.1 v81.2,33.8 | v81.5,31.3 82,31.8 v82.9,31.8 | GP20,GP21,GP22.3 71.51,12.19 70.7,13 66.4,13 63.7,10.3 60.5,10.3 59.4,9.2 57.7,9.2 56.7,8.2 38.7,8.2 36.1,10.8 36.1,12.2 33.9,14.4 31.7,14.4 30.51,13.21 | 30.51,13.21 GP7,GP10,GP11.3 | GP2,GP3,GP6.3 15.51,13.91 16,14.4 29.32,14.4 30.51,13.21
  pour Bottom (no thermals): 80.2,30.2 80.2,34.1 80.6,34.5 81.6,34.5 82,34.1 82,33.4 82,32.4 82.2,32.2 82.9,32.2 84.5,30.6 85.2,30.6 85.3,30.5 85.3,30 85.2,29.9 83.8,29.9 83,29.9 82.7,29.6 80.6,29.6 80.2,30
  pour Top (no thermals): 80.1,30 80.1,34.2 80.4,34.5 81.6,34.5 82,34.1 82,32.6 82.3,32.3 83,32.3 83.1,32.2 91.6,32.2 92.1,31.7 92.1,29.5 91.8,29.2 91.8,15.5 89.7,13.4 88.8,13.4 87.2,11.8 87.2,11 86.8,10.6 86.1,10.6 85.7,11 85.7,12.1 85.6,12.2 85.6,12.4 85.2,12.8 85.2,13.5 86.3,14.6 89.6,14.6 90.8,15.8 90.8,29.1 88.8,31.1 86.2,31.1 85.2,30.1 85.2,30 84.6,29.4 80.7,29.4
GND  (via drill 0.35)
  Top 0.152: v65,45.6 65.2,45.4 R1.2 | v64.3,43.3 64.3,44.9 v65,45.6 | v75,47.1 73.45,48.65 73.45,50.05 v73.7,50.3 | U$10.61 38.92,17.4 | 62.1,55.65 U$10.66 | PWM12_SPI1_MISO.GND PWM13_SPI1_SS.GND PWM14_SPI1_SCK.GND | 88.43,33.61 PWM14_SPI1_SCK.GND | PWM14_SPI1_SCK.GND PWM15_SPI1_MOSI.GND | 50.5,13.2 U$10.42 50.62,12.58 50.5,12.46 | C7.1 | C7.1 71.63,25.1 C6.1 | C7.1 70.99,23.8 C4.1 70.44,22.83 70.4,22.8 v70.4,22.3 v69,22.3 | U2.3:GND 73.23,27.48 v72.3,28.4 v71.2,28.4 71.2,28.8 v70.5,29.5 v71.8,29.5 71.8,30.4 v71.7,30.5 v70.4,30.5 70.4,31.5 v70.3,31.6 v71.7,31.6 71.7,32.3 v71.3,32.7 v70.1,32.7 70,32.7 v69.3,32 v69.3,30.7 v69.3,29.5 | v77.3,25.6 v78.8,25.6 v80.2,25.6 v80.2,24.2 v78.8,24.2 v77.3,24.2 v77.3,22.7 77.4,22.6 v78.8,22.6 v80.2,22.6 80.2,17.1 v80.1,17 | v76.8,17 v78.5,17 | v78.5,17 v80.1,17 | v80.1,17 80.1,15.5 v80,15.4 v78.4,15.4 v76.8,15.4 75.9,15.4 v74.9,14.4 | v65.4,19.2 v65.4,20.7 | v65.4,20.7 v66.9,20.7 v68.3,20.7 | v68.3,20.7 v69.8,20.7 | v65.4,19.2 65.5,19.3 v66.9,19.3 v68.3,19.3 | v69,22.3 69,21.4 v68.3,20.7 | v67.9,22.3 v69,22.3 | R6.1 66.05,25.8 64.8,25.8 64.3,25.3 | v65.4,20.7 64.3,21.8 64.3,25.3 | 72.65,5.25 v72.8,5.4 v74.6,5.4 | 72.65,5.25 71.6,4.2 v67.6,4.2 | v89.7,49.8 87.5,49.8 v87.4,49.9 87.3,49.8 85.6,49.8 84.8,50.6 v84.6,50.6 | v70.5,34.8 70.6,34.7 v72.2,34.7 72.2,36.05 C1.1 71.52,36.28 v70.6,37.2 v70.6,39.1 v68.7,39.1 v68.7,37.2 68,36.5 v68,35.6 67.7,35.3 66.5,35.3 65.3,34.1 v65.3,33.9 | 80.9,9.2 v80.9,11.1 v78.8,11.1 v76.8,11.1 76.78,11.08 GP20,GP21,GP22.1 | 80.9,9.2 v80.9,9.1 | v80.9,9.1 v78.8,9.1 v76.8,9.1 | v70.3,5.4 72.5,5.4 72.65,5.25 | 80.9,9.2 81.5,9.8 88.2,9.8 88.55,10.15 UART1(GP8,GP9).1
  Top 0.152: v80.9,9.1 80.9,8.3 82.1,7.1 82.4,7.1 v83.3,6.2 83.7,6.2 v85.7,4.2 85.7,5.1 v87.1,6.5 87.1,5.1 v87,5 | v86.4,43.6 v88.6,43.6 | 59.34,17.6 U$10.23 | v72.9,59.3 72,60.2 v72,61.5 | v78.5,18.9 v78.5,17 | v84.75,47.62 87.02,47.62 v87.3,47.9 | v56.5,6 57.3,5.2 57.3,4.51 | 57.3,4.51 v57.3,4.5 | 57.3,4.51 58.62,4.51 v59,4.9 58.05,5.85 58.02,5.85 58.02,6.68 J2.GND1 | 90.1,24.6 v89.1,24.6 U$11.3 89.1,22.9 v90.1,21.9 | U$17.P$2 87.52,28.72 | 87.52,28.72 87.11,29.13 U$17.P$4 87.11,29.88 U$17.P$1 88.02,29.88 U$17.P$3 88.02,29.22 87.52,28.72 | v88.4,3.2 88.9,3.7 v91.4,3.7 91.5,3.7 v93,2.2 92.1,1.3 v91.5,1.3 | v40.64,10.16 v40.64,6.35 | v40.64,6.35 v39.37,5.08 | v40.64,6.35 v41.91,5.08 v43.18,6.35 v44.45,5.08 v45.72,6.35 | v45.72,6.35 v46.99,5.09 | v46.99,5.09 v46.99,5.08 | v46.99,2.54 v45.72,3.81 | v45.72,3.81 v44.45,2.54 v43.18,3.81 v41.91,2.54 v40.64,3.81 v39.37,2.54 v33.02,2.54 | 62.45,30.25 63.4,29.3 63.4,26.2 64.3,25.3 | 62.45,30.25 U$10.76 | RESET.C RESET.D 14.38,20.68 12.2,18.5 12.2,15.4 13.5,14.1 16.1,14.1 17.55,12.65 GP2,GP3,GP6.1 | GP7,GP10,GP11.1 32.55,15.95 27.82,20.68 RESET.C | v35.6,9.2 38,9.2 39,10.2 40.6,10.2 v40.64,10.16 | U$10.18 43.95,17.55 | 43.95,17.55 44.2,17.3 44.2,11.1 43.26,10.16 v40.64,10.16 | U$10.81 63.58,19.2 v65.4,19.2 | v45.72,3.81 v46.99,5.08 v46.99,5.09 | U$10.85 v50.5,4.6 | 43.95,17.55 43.95,18.05 v44.4,18.5 | v47.7,21.2 47.7,24.13 | 47.7,24.13 47.7,28.3 45.75,30.25 45.72,30.25 | 45.72,30.25 U$10.13 | v64.2,31.2 63.25,30.25 62.45,30.25 | v65,45.6 64.3,45.6 63.1,46.8 53.9,46.8 v50.9,43.8 | U$10.3 43.45,55.65 | 45.85,43.05 46.03,43.23 46.03,53.07 43.45,55.65 | 45.85,43.05 45.7,42.9 41.66,42.9 U$10.8
  Top 0.152: v29.21,58.42 v27.94,59.69 | v27.94,62.23 v26.67,60.96 26.42,60.96 24.9,62.49 v19.05,62.49 | v30.48,62.23 v29.21,60.96 | v34.29,33.02 33.02,31.75 v31.75,31.75 | v27.94,36.83 29.21,35.56 v33.02,35.56 31.75,36.83 v31.75,39.12 | v22.86,29.21 v21.59,27.94 | v20.32,29.21 v21.59,30.48 | v31.75,3.81 v30.48,2.54 | v29.21,3.81 v27.94,2.54 | v26.67,3.81 v25.4,2.54 | v17.78,3.81 v16.51,2.54 | v15.24,3.81 v13.97,2.54 | v12.7,3.81 v11.43,2.54 | v8.89,46.99 v8.89,44.45 | v8.89,41.91 v8.89,39.37 | v8.89,36.83 v8.89,34.29 | v10.16,35.56 v10.16,38.1 | v10.16,40.64 11.43,39.37 v11.43,36.83 11.94,37.34 v14.74,37.34 17.02,35.05 v17.28,35.05 v17.28,29.72 17.02,29.97 v14.74,29.97 12.2,29.97 v11.43,29.21 | v8.89,29.21 v10.16,27.94 | v8.89,26.67 v10.16,25.4 11.31,26.54 | 11.31,26.54 v11.43,26.67 | v8.89,24.13 v8.89,21.59 | v10.16,20.32 v8.89,19.05 | v10.16,17.78 v8.89,16.51 | v10.16,15.24 v8.89,13.97 | v10.16,12.7 v8.89,11.43 | 45.72,30.25 45.72,30.48 v46.99,31.75 | v49.53,31.75 v52.07,31.75 | v54.61,31.75 54.61,30.48 v53.34,29.21 | 45.85,43.05 v46.99,41.91 48.26,43.18 v48.26,45.72 | v46.99,38.1 v45.72,36.83 47.76,34.8 v47.76,33.78 | 43.45,55.65 44.22,55.65 v45.72,57.15 | v53.34,44.45 53.34,43.18 v52.07,41.91 | v55.88,41.91 55.88,40.64 v54.61,39.37 | v52.84,36.58 v52.84,33.78 v54.87,33.78 | v45.72,6.35 v45.72,9.91 v45.72,13.72 45.72,17.02 v46.23,17.53 | v49.28,21.34 50.3,22.35 v54.11,22.35 v52.84,21.08 52.84,20.07 v54.11,18.8 | v51.82,25.15 v48.77,25.15 47.76,24.13 47.7,24.13 | RESET.C 26.06,20.68 v24.39,22.35 | v20.32,23.37 v17.28,23.37 16.26,22.35 v14.74,22.35 14.48,22.1 v12.2,22.1 | v11.43,24.13 11.43,26.42 11.31,26.54
  Top 0.152: v17.78,58.93 17.53,58.68 v14.48,58.68 | v11.43,60.71 9.91,60.71 v8.64,61.98 | v14.74,47.75 16.26,49.28 v16.26,50.55 | v46.99,55.88 47.5,55.37 v47.5,52.83 v47.5,49.02 50.04,49.02 v50.8,48.26
  Top 0.813: U$10.28 U$10.76 | U$10.23 U$10.81 | U$10.46 U$10.3 | U$10.51 U$10.8 | U$10.56 U$10.13 | U$10.61 U$10.18 | U$10.38 62.1,55.65 | U$10.85 50.5,12.46
  Bottom 0.152: 42.15,55.65 U$10.3 | PWM12_SPI1_MISO.GND 82.82,33.74 | v77.3,25.6 75.1,25.6 v72.3,28.4 | v69.8,20.7 73.1,20.7 v76.8,17 75.2,15.4 73.5,15.4 73.1,15 73.1,11.53 GP20,GP21,GP22.1 | v76.8,9.1 73.1,5.4 v72.8,5.4 | v67.6,4.2 67.3,3.9 60,3.9 v59,4.9 | 56.3,4.5 v57.3,4.5 | v87.3,47.9 87.3,49.8 v87.4,49.9 | v90.4,48.5 90.4,49.1 v89.7,49.8 89.7,51.6 v89.6,51.7 v91.4,51.7 91.4,52.2 v90.7,52.9 90.8,53 v90.8,55.5 | v70.1,32.7 70.1,34.4 v70.5,34.8 | v72.2,34.7 74.9,34.7 v75.7,33.9 75.7,32.3 v75.6,32.2 | v82.7,49.9 83.4,50.6 v84.6,50.6 | v76.8,18.9 v78.5,18.9 v80.1,18.9 | v88.6,43.6 v91.1,43.6 v93.2,43.6 v93.2,46.8 v93.2,49.9 v93.2,52.8 v93.2,55.5 v90.8,55.5 | v90.8,55.5 89.4,56.9 89.4,58.3 89.2,58.5 v87,58.5 v84,58.5 v84,61.5 | v84,61.5 v81,61.5 v78,61.5 v75,61.5 72.1,61.5 | v84,61.5 v87,61.5 v90,61.5 v93,61.5 v93,63 v90,63 v87,63 v84,63 v81,63 v78,63 v75,63 | 72.1,61.5 v72,61.5 | 72.1,61.5 72,61.6 v72,63 v69,63 v69,59 67.6,60.4 v67.4,60.4 | v64.9,60.4 v67.4,60.4 | v67.4,60.4 67.2,60.4 v65.9,61.7 v64,61.7 64,60.2 63.3,59.5 57.5,59.5 56.9,58.9 56.9,56.3 57.55,55.65 U$10.38 | PWM14_SPI1_SCK.GND 88.34,33.7 C8.1 88.34,31.11 U$17.P$1 | 86.17,27.38 R9.1 87.2,27.3 88.79,25.71 R8.1 88.98,24.73 v89.1,24.6 | 86.17,27.38 U$17.5 87.42,28.53 U$17.P$2 | R10.1 91.22,23.02 v90.1,21.9 | C9.1 84.9,32.8 PWM13_SPI1_SS.GND | 86.17,27.38 86.02,27.52 C5.1 84.3,26.91 v84.3,25.9 v84.3,24.5 84.3,21.7 83.5,20.9 v83.5,14.8 85.8,14.8 88.55,12.05 UART1(GP8,GP9).1 | U$17.9 U$17.P$4 | v85.7,4.2 85.9,4.2 v87.7,2.4 87.7,2.5 v88.4,3.2 | U$10.46 38.55,55.65 33.7,50.8 28.2,50.8 27.45,51.55 27.45,52.9 UART0(GP0,GP1).1 26.67,53.7 26.67,57.15 27.94,58.42 v29.21,58.42 29.98,57.66 v30.99,57.66
  Bottom 0.152: GP7,GP10,GP11.1 34.43,9.2 v35.6,9.2 | v72.9,59.3 73.2,59.3 74.9,57.6 74.9,54.8 74.3,54.2 v74.3,53.6 74.3,50.9 v73.7,50.3 69.4,50.3 68.45,51.25 I2C1(GP4,GP5).1 65,49.47 v65,45.6 | v46.99,2.54 48.44,2.54 v50.5,4.6 50.5,6.1 51.4,7 55.5,7 v56.5,6 | v44.4,18.5 47.1,21.2 v47.7,21.2 | U$10.56 36.4,32.92 36.4,33.02 | 36.4,33.02 36.4,35.6 37.4,36.6 43.2,36.6 44,37.4 44,42.2 | U$10.8 43.25,42.95 44,42.2 | v65.3,33.9 64.2,32.8 v64.2,31.2 | v50.9,43.8 45.6,43.8 44,42.2 | v27.94,59.69 v26.67,60.96 | v27.94,62.23 v30.48,62.23 | v29.21,60.96 v30.48,59.69 | 36.4,33.02 v34.29,33.02 33.02,34.29 v33.02,35.56 34.55,35.56 v35.06,35.05 35.06,36.58 v35.31,36.83 | v31.75,31.75 33.02,30.48 v33.02,29.21 | v27.94,36.83 22.86,31.75 v22.86,29.21 | v21.59,27.94 v20.32,29.21 | v21.59,30.48 v20.32,31.75 19.56,32.51 v19.56,33.78 | v33.02,2.54 v31.75,3.81 | v30.48,2.54 v29.21,3.81 | v27.94,2.54 v26.67,3.81 | v25.4,2.54 19.05,2.54 v17.78,3.81 | v16.51,2.54 v15.24,3.81 | v13.97,2.54 v12.7,3.81 | SPI0(GP16,GP17,GP18,GP19).1 8.89,49.36 v8.89,46.99 | v8.89,44.45 v8.89,41.91 | v8.89,39.37 v8.89,36.83 | v10.16,35.56 v8.89,34.29 v8.89,29.21 | v10.16,38.1 v10.16,40.64 | v10.16,27.94 v8.89,26.67 | v10.16,25.4 v8.89,24.13 | v11.43,26.67 v11.43,29.21 | v8.89,21.59 v10.16,20.32 | v8.89,19.05 v10.16,17.78 | v8.89,16.51 v10.16,15.24 | v8.89,13.97 v10.16,12.7 | v8.89,11.43 v10.16,10.16 | v49.53,31.75 v46.99,31.75 47.76,32.51 v47.76,33.78 | v52.07,31.75 v54.61,31.75 | v53.34,29.21 v50.8,29.21 | v46.99,41.91 v45.72,40.64 46.99,39.37 v46.99,38.1 | v46.99,55.88 v45.72,57.15 45.72,59.69 v46.49,60.45 48.26,62.23 v49.03,62.23 50.3,62.23 v51.31,61.22 52.33,61.22 v53.6,62.49
  Bottom 0.152: v48.26,45.72 v50.8,48.26 53.34,45.72 v53.34,44.45 | v52.07,41.91 v55.88,41.91 | v52.84,36.58 52.84,37.59 v54.61,39.37 56.65,39.37 v57.41,38.61 | v46.23,17.53 46.74,18.04 v49.28,18.04 v49.28,21.34 | v24.39,22.35 23.37,23.37 v20.32,23.37 | v19.31,16.26 17.28,18.29 v17.28,23.37 | v12.2,22.1 11.43,22.86 v11.43,24.13 | v19.05,62.49 17.78,61.22 v17.78,58.93 18.55,58.17 18.55,56.64 v19.82,55.37 | v14.48,58.68 13.47,58.68 v11.43,60.71 | v8.64,61.98 9.4,62.74 v14.23,62.74 | v19.82,55.37 19.82,54.87 18.93,53.98 | 18.93,53.98 v18.8,53.85 | v16.26,50.55 17.28,50.55 18.04,51.31 v18.04,52.07 18.93,52.96 18.93,53.98 | v19.82,55.37 20.07,55.63 v22.61,55.63 | v45.72,25.15 v48.77,25.15
  Bottom 0.305: SPI0(GP16,GP17,GP18,GP19).1 12.45,50.45 13.6,49.3 23.85,49.3 27.45,52.9
  other vias: 57.15,18.8
  pour Bottom (rank 6): -11.7,84.4 121.7,84.4 121.7,-13.9 -11.7,-13.9
  pour Top (rank 6): -11.5,84.2 121.3,84.2 121.3,-13.3 -11.5,-13.3
  pour Top: 70.7,27.8 69.6,28.9 69.3,28.9 68.8,29.4 68.8,32.3 69.8,33.3 71.7,33.3 72.7,32.3 72.7,31.3 72.24,30.84 72.74,28.66 73.7,27.7 73.7,27.5 72.8,27.5 72.5,27.8
GP0
  Top 0.813: U$10.44 U$10.1
  Bottom 0.152: U$10.1 42.77,60.73 44,59.5 44,57.8 43.1,56.9 37.8,56.9 33.82,52.92 UART0(GP0,GP1).5
GP1
  Top 0.813: U$10.45 U$10.2
  Bottom 0.152: UART0(GP0,GP1).6 32.55,58.35 34.5,60.3 37,60.3 39.07,58.23 U$10.45
GP2
  Top 0.152: 39.07,53.13 U$10.47
  Top 0.813: U$10.47 U$10.4
  Bottom 0.152: U$10.47 38.87,52.91 37.87,52.91 34.56,49.6 27.4,49.6 24.1,46.3 18.2,46.3 13.47,41.57 GP2,GP3,GP6.5
GP3  (via drill 0.35)
  Top 0.152: v15.9,17.4 15.9,16.5 19.2,13.2 19.2,8.8 17.2,6.8 15,6.8 14.49,7.31 GP2,GP3,GP6.4
  Top 0.813: U$10.48 U$10.5
  Bottom 0.152: U$10.48 38.17,50.57 35.6,48 29,48 24.4,43.4 19.1,43.4 15.9,40.2 v15.9,17.4
GP4  (via drill 0.35)
  Top 0.152: 41.71,48.13 U$10.6 | U$10.49 38.23,48.03 37,46.8 37,45.1 37.9,44.2 44.5,44.2 v45.1,44.8 | R14.1 51.48,52.93 v52.6,51.8 62.9,51.8 65,49.7 70.9,49.7 72.6,51.4 72.6,52.85 I2C1(GP4,GP5).5
  Top 0.813: U$10.49 U$10.6
  Bottom 0.152: v45.1,44.8 48.7,48.4 48.7,50.5 50,51.8 v52.6,51.8
GP5  (via drill 0.35)
  Top 0.152: 38.79,45.49 U$10.50 | R15.1 53.14,56.47 v55.2,54.4
  Top 0.813: U$10.50 U$10.7
  Bottom 0.152: I2C1(GP4,GP5).4 71.51,56.79 70.8,57.5 67.9,57.5 64.8,54.4 v55.2,54.4 46.4,54.4 44.9,52.9 44.9,47 43.39,45.49 U$10.7
GP6  (via drill 0.35)
  Top 0.152: v21.1,17.8 22.4,16.5 v22.4,11.4
  Top 0.813: U$10.52 U$10.9
  Bottom 0.152: U$10.52 20.11,40.41 18.4,38.7 18.4,20.3 20.9,17.8 v21.1,17.8 | v22.4,11.4 17.1,6.1 13.4,6.1 12.45,7.05 GP2,GP3,GP6.6
GP7  (via drill 0.35)
  Top 0.152: v26,17.5 26,9.99 GP7,GP10,GP11.6
  Top 0.813: U$10.53 U$10.10
  Bottom 0.152: 41.63,37.87 U$10.10 | U$10.53 31.77,37.87 26,32.1 v26,17.5
GP8
  Top 0.813: U$10.54 U$10.11
  Bottom 0.152: UART1(GP8,GP9).5 84.47,12.33 82.1,14.7 82.1,20.7 83.3,21.9 83.3,26.7 82.2,27.8 79.4,27.8 78.1,29.1 78.1,38.1 74.1,42.1 66.9,42.1 63.5,38.7 63.5,37 63,36.5 58.73,36.5 58.72,36.5 55.3,36.5 54.39,35.59 41.87,35.59 U$10.11
GP9  (via drill 0.35)
  Top 0.152: v81.5,14.4 81.5,20.3 82.7,21.5 82.7,26.8 81.4,28.1 79.7,28.1 78.5,29.3 78.5,37.6 75.4,40.7 68.1,40.7 66.9,39.5 66.9,38.2 64.5,35.8 v64.5,35.2
  Top 0.813: U$10.55 U$10.12
  Bottom 0.152: v81.5,14.4 81.5,10.5 82,10 82,9.99 UART1(GP8,GP9).6 | U$10.12 43.62,34.8 57.66,34.8 58.42,34.04 63.34,34.04 v64.5,35.2
GP10  (via drill 0.35)
  Top 0.152: v27.8,17.5 27.8,11.75 GP7,GP10,GP11.5
  Top 0.813: U$10.57 U$10.14
  Bottom 0.152: U$10.57 31.11,27.71 27.8,24.4 v27.8,17.5
GP11  (via drill 0.35)
  Top 0.152: GP7,GP10,GP11.4 29.49,7.11 30.3,6.3 32.9,6.3 34.2,7.6 34.2,17.06 29,22.26 v29,22.6
  Top 0.813: U$10.58 U$10.15
  Bottom 0.152: 41.61,25.11 U$10.15 | v29,22.6 29,24 30.6,25.6 35.5,25.6 36,25.1 39,25.1 U$10.58
GP12  (via drill 0.35)
  Top 0.152: v51.6,17.8 51.6,5.6 55.2,2 85.1,2 89.4,6.3 89.4,8.4 93.1,12.1 93.1,40.2 92.9,40.4 84.6,40.4 83.3,39.1 PWM12_SPI1_MISO.I/O
  Top 0.813: U$10.59 U$10.16
  Bottom 0.152: v51.6,17.8 51.6,20.7 49.67,22.63 U$10.16
GP13  (via drill 0.35)
  Top 0.152: U$10.17 45.21,20.09 49.2,16.1 49.2,3.2 51.3,1.1 85,1.1 90,6.1 90,7.9 93.7,11.6 93.7,40.7 92.8,41.6 v91.9,41.6
  Top 0.813: U$10.60 U$10.17
  Bottom 0.152: v91.9,41.6 86.7,41.6 85.8,40.7 85.8,38.86 PWM13_SPI1_SS.I/O
GP14  (via drill 0.35)
  Top 0.152: 42.11,15.01 U$10.19 | v53.4,14.7 54.7,13.4 54.7,7.6 v52.9,5.8
  Top 0.813: U$10.62 U$10.19
  Bottom 0.152: U$10.19 41.7,15.1 53,15.1 v53.4,14.7 | v52.9,5.8 52.9,4.5 56,1.4 88.9,1.4 89.9,2.4 89.9,10.1 93.2,13.4 93.2,39.9 92.3,40.8 88.8,40.8 88.3,40.3 PWM14_SPI1_SCK.I/O
GP15  (via drill 0.35)
  Top 0.152: v55.7,11.5 55.7,7.8 54,6.1 54,4.6 55.9,2.7 v84,2.7
  Top 0.813: U$10.63 U$10.20
  Bottom 0.152: U$10.63 37.63,12.47 37.1,13 37.1,15.6 37.8,16.3 53.7,16.3 55.7,14.3 v55.7,11.5 | v84,2.7 85.8,2.7 86.66,1.85 87.93,1.85 88.19,2.1 88.5,2.1 89.3,2.9 89.3,10.2 92.8,13.7 92.8,36.94 PWM15_SPI1_MOSI.I/O
GP16
  Top 0.152: U$10.21 58.53,12.47 51.7,19.3 48.1,19.3 46,21.4 35.46,21.4 19.7,37.16 19.7,51.9 17.4,54.2 15.9,54.2 15.51,54.59 SPI0(GP16,GP17,GP18,GP19).4
  Top 0.813: U$10.21 U$10.83
GP17  (via drill 0.35)
  Top 0.152: 59.39,14.44 U$10.22 | SPI0(GP16,GP17,GP18,GP19).6 18.3,55.46 21.2,52.56 21.2,37.6 32.3,26.5 v36.5,26.5 36.76,26.25 v36.76,22.69
  Top 0.813: U$10.22 U$10.82
  Bottom 0.152: v36.5,26.5 52.2,26.5 55.9,22.8 55.9,16.8 57.69,15.01 U$10.22 | v32.95,17.1 35.49,17.1 v35.74,17.36 36.76,18.37 v36.76,19.9 v36.76,22.69
GP18  (via drill 0.35)
  Top 0.152: v35.8,29.1 34.4,30.5 30.6,30.5 22.7,38.4 22.7,53.61 19.11,57.2 14.3,57.2 13.47,56.37 SPI0(GP16,GP17,GP18,GP19).2
  Top 0.813: U$10.24 U$10.80
  Bottom 0.152: U$10.24 58.21,20.09 57.2,21.1 57.2,23.7 53,27.9 44.1,27.9 43,29 35.9,29 v35.8,29.1
GP19  (via drill 0.35)
  Top 0.152: v52.5,23.9 56.6,23.9 57.87,22.63 U$10.25 | v30.9,24 30.6,24 18.05,36.56 18.05,50.64 16.53,52.16 SPI0(GP16,GP17,GP18,GP19).5
  Top 0.813: U$10.25 U$10.79
  Bottom 0.152: v52.5,23.9 31,23.9 v30.9,24
GP20  (via drill 0.35)
  Top 0.152: GP20,GP21,GP22.5 69.3,11.25 v69.3,14.4
  Top 0.813: U$10.26 U$10.78
  Bottom 0.152: U$10.78 63.23,25.17 64.2,24.2 64.2,17.1 65,16.3 67.1,16.3 69,14.4 v69.3,14.4
GP21  (via drill 0.35)
  Top 0.152: GP20,GP21,GP22.4 70.49,8.71 69.3,9.9 68,9.9 67.6,10.3 v67.6,14.5
  Top 0.813: U$10.27 U$10.77
  Bottom 0.152: v67.6,14.5 66.7,15.4 64.2,15.4 63.5,16.1 63.5,23.1 62.7,23.9 58.5,23.9 57.6,24.8 57.6,26.6 58.71,27.71 U$10.27
GP22  (via drill 0.35)
  Top 0.152: U$10.75 65.89,32.79 v67.1,34
  Top 0.813: U$10.29 U$10.75
  Bottom 0.152: v67.1,34 67.1,39.2 68.1,40.2 72.5,40.2 76.6,36.1 76.6,28.3 78.5,26.4 81.5,26.4 82.1,25.8 82.1,22.4 80.7,21 80.7,19.5 81,19.2 81,15 79.1,13.1 76,13.1 75.1,12.2 75.1,8.5 73.2,6.6 68.8,6.6 68.45,6.95 GP20,GP21,GP22.6
GP26(A0)  (via drill 0.35)
  Top 0.152: v81.4,45.1 81.4,44.1 78.7,41.4 v78.3,41.4
  Top 0.813: U$10.31 U$10.73
  Bottom 0.152: v81.4,45.1 81.4,46 85,49.6 85.5,49.6 87.53,51.63 ANALOG(GP26,GP27,GP28).5 | U$10.73 62.7,38.64 62.7,39.2 66.4,42.9 74.5,42.9 76,41.4 v78.3,41.4
GP27(A1)  (via drill 0.35)
  Top 0.152: v81.9,43.3 78.7,40.1 77.9,40.1 76.4,41.6 63.12,41.6 U$10.72 | R13.1 51.98,37.92 54.93,37.92 57.41,40.41 U$10.32
  Top 0.813: U$10.32 U$10.72
  Bottom 0.152: v81.9,43.3 82,43.2 84.3,43.2 88.6,47.5 88.6,51.8 89.1,52.3 89.1,53.5 88.5,54.1 87.87,54.1 ANALOG(GP26,GP27,GP28).4
GP28(A2)  (via drill 0.35)
  Top 0.152: v78.3,42.9 78.8,42.9 80.3,44.4 v80.3,46.3 | v81.5,51 81.5,55.9 83,57.4 87.5,57.4 88.55,56.35 ANALOG(GP26,GP27,GP28).6 | R12.1 52.14,40.04 57.59,45.49 U$10.34
  Top 0.813: U$10.34 U$10.70
  Bottom 0.152: v78.3,42.9 78.3,42.8 77.9,42.4 76.7,42.4 75.3,43.8 66.1,43.8 64,41.7 58.7,41.7 58,42.4 58,44.5 58.99,45.49 U$10.34 | v80.3,46.3 81.5,47.5 v81.5,51
IN_BAT1
  Top 1.016: J2.VCC 62.2,6.79 65.8,10.39 P1.2
  pour Top: 59.3,6 59.3,7.4 59.4,7.5 62.11,7.5 63.7,9.1 63.7,15.7 65.2,17.2 65.2,18.3 65.5,18.6 66.3,18.6 66.7,18.2 66.7,8.4 66.2,7.9 64.17,7.9 61.67,5.4 59.9,5.4
IN_BAT2  (via drill 0.35)
  Top 0.152: U2.1:IN 73.38,26.5 73.55,26.5 74.29,25.77 73.63,25.1 | v74.7,21.7 74.7,22.72 C7.2 | v65,26.9 65.44,27.34 R3.1 | P1.1 73.63,22.33 C7.2 | C7.2 73.63,25.1 | 73.63,25.1 C6.2 74.12,25.3 SW1.TP
  Bottom 0.152: v65,26.9 65,22.4 65.7,21.7 v74.7,21.7
  pour Top (no thermals): 68.1,17.1 68.1,18 72.7,22.6 72.7,25.95 73.28,26.52 76.1,24.7 76.1,17.7 74.2,15.8 69.4,15.8
N$1
  Top 0.152: R1.1 LED1.CATHODE
N$2
  Top 0.152: ANALOG(GP26,GP27,GP28).3 85.49,51.41 86.3,50.6 90.6,50.6 91.7,49.5 91.7,45.2 91.1,44.6 87.4,44.6 U$1.2
N$3
  Top 0.305: U$8.2 30,42.8 30.4,43.2 34.9,43.2 35.7,44 35.7,55.5 33.2,58 33.2,60.2 35.1,62.1 43.13,62.1 46.53,58.7 54,58.7 58.3,54.4 62.9,54.4 66.4,50.9 70,50.9 70.5,51.4 I2C1(GP4,GP5).3
  Top 0.61: U$8.2 30,39.1 28.9,38 26.1,38 24.3,39.8 24.3,47 | UART0(GP0,GP1).3 29.49,52.19 24.3,47 | 24.3,47 24.3,54.2 26.4,56.3 26.4,59.3 25.2,60.5 14,60.5 11.5,58 11.5,55.8 9.6,53.9 9.6,51.1 11.4,49.3 13.8,49.3 14.49,49.99 SPI0(GP16,GP17,GP18,GP19).3
N$4
  Bottom 0.152: R8.2 88.97,27.32 U$17.4
N$5  (via drill 0.35)
  Top 0.152: v87.8,21.5 86.8,20.5 U$9.2
  Bottom 0.152: U$17.3 89.32,29.18 90.1,28.4 90.1,23.8 v87.8,21.5
N$7  (via drill 0.35)
  Top 0.152: v85.32,19.24 84.83,19.24 84.1,19.96 U$9.3
  Bottom 0.152: R9.2 86.24,20.16 v85.32,19.24
N$8
  Bottom 0.152: R10.2 90.8,28.8 89.77,29.83 U$17.2
N$9
  Top 0.152: U2.4:BST 70.18,27.48 68.17,29.49 R2.1
N$10
  Top 0.152: C2.2 R2.2
N$11
  Top 0.152: U2.6:FB 71.06,26.48 70.59,26.01 R4.1 70.44,25.86 C4.2
N$12
  Bottom 0.152: U$17.1 88.99,30.5 89.7,30.5 89.98,30.78 R11.2
N$13  (via drill 0.35)
  Top 0.152: v66.36,22.3 66.28,22.38 R7.1 | v75,36 74.5,35.5 73.97,35.5
  Top 0.61: L1.2 73.97,34.05 73.97,35.5 C1.2 73.97,38.28 D1.ANODE
  Bottom 0.152: v66.36,22.3 68,23.95 68,33.9 70.1,36 v75,36
N$14
  Top 0.152: R5.1 68.97,24.89 R4.2 R6.2 C3.1
N$15
  Top 0.152: R5.2 67.99,23.24 R7.2 67.76,23.35 67,24.1 67,24.4 66.71,24.7 C3.2
PICO_5V  (via drill 0.35)
  Top 0.152: v78.9,48.8 v78.9,50.6 v78.9,52.5 v78.9,54.2 v77.3,54.2 v77.3,52.5 v77.3,50.6 v77.3,48.8 77.3,46.8 74.3,43.8 74,43.8 73.9,43.7 73.9,42.96 | v78.2,47.6 79,48.4 79,48.8 79,48.9 | PWM15_SPI1_MOSI.VCC 92.5,34.7 92.5,29.3 92.14,28.93 92.14,14.63 v91.4,13.9 | v87.6,19 87.6,19.2 88.9,20.5 U$9.1 | LED1.ANODE 71.7,44.8 71.7,44.1 72.84,42.96 73.9,42.96 | 73.9,42.96 D1.CATHODE | 59.1,58.19 U$10.39
  Top 0.254: U$1.1 88.5,48.1 87.7,48.9 79,48.9 | v78.9,48.8 79,48.8
  Top 0.406: 91.1,36.28 PWM15_SPI1_MOSI.VCC
  Top 0.508: 56.4,59.7 48.8,59.7 45.4,63.1 34.1,63.1 32.3,61.3 32.3,57.8 34.2,55.9 34.2,52.6 32.5,50.9 30.5,50.9 25.7,46.1 25.7,41.7 26.6,40.8 U$8.1 | 77.3,54.3 74.4,57.2 72.8,57.2 66.9,63.1
  Top 0.61: 66.9,63.1 57.1,63.1 56.4,62.4 56.4,59.7 57.91,58.19 59.1,58.19
  Top 0.813: 77.3,54.3 v77.3,54.2 | U$10.39 U$10.65
  Top 1.27: PWM15_SPI1_MOSI.VCC PWM14_SPI1_SCK.VCC PWM13_SPI1_SS.VCC PWM12_SPI1_MISO.VCC
  Bottom 0.152: U$17.6 84.98,29.18 C5.2 | v91.4,13.9 87.6,17.7 v87.6,19
  Bottom 0.813: C5.2 83.22,29.12 82.7,28.6 80.2,28.6 79.3,29.5 79.3,36.1 80,36.8
  Bottom 1.27: v77.3,54.2 77,53.9 77,47.4 80,44.4 80,36.8 80.53,36.28 PWM12_SPI1_MISO.VCC
  pour Bottom (no thermals): 76,48.4 76,54 77.2,55.2 79.5,55.2 80.3,54.4 80.4,54.3 80.4,48.7 80.4,48 79,46.6 78.7,46.3 77.2,46.3 76,47.5
  pour Top: 75.2,54.6 76.5,55.9 80.4,55.9 80.5,55.8 80.5,50 81.1,49.4 81.1,48.9 78.1,45.9 77.1,45.9 75.2,44 75.2,42.3 74.9,42 73.1,42 72.9,42.2 72.9,44 72.7,44.2 72.7,44.5 72.8,44.6 74.4,44.6 75.7,45.9 75.7,49.6 75.2,50.1
POWERON  (via drill 0.35)
  Top 0.152: 67.8,27.34 68.27,27.34 68.63,26.98 U2.5:EN | 67.8,27.34 R3.2 | v65.7,38.6 65.7,39.1 67.8,41.2 76,41.2 79.4,37.8 79.4,29.3 79.7,29 84.8,29 85.4,28.4 85.4,24.2 U$11.2 | v65.6,28.9 66,28.5 67.44,28.5 67.8,28.14 67.8,27.34
  Bottom 0.152: v65.7,38.6 65.7,37.9 66.2,37.4 66.2,32 65.6,31.4 v65.6,28.9
RESET  (via drill 0.35)
  Top 0.152: v29.7,32.8 31,34.1 42.93,34.1 43,34.1 46.17,34.1 47.5,32.77 55.63,32.77 58.19,35.33 U$10.30 | RESET.A 26.6,25.3 | 26.6,25.3 26.6,26.2 v26.9,26.5 | RESET.B 26.48,25.18 26.6,25.3
  Top 0.813: U$10.30 U$10.74
  Bottom 0.152: v26.9,26.5 28.5,28.1 28.5,31.6 v29.7,32.8
SW_OUT
  Top 0.152: U2.2:SW 73.98,26.98 74.2,27.2 74.85,27.2 SW.TP 75.38,28.46 L1.1 74.07,30.06 74.07,31.43 71.8,33.7 69.6,33.7 68.17,32.27 C2.1
  pour Top (no thermals): 73.4,26.9 73.6,27.1 73.8,27.1 74.1,27.4 74.1,28.1 73.1,29.1 73.1,30.9 73.4,31.2 76.5,31.2 76.8,30.9 76.8,26.1 76.46,25.76 75.13,25.76 73.98,26.9
SWCLK
  Top 0.152: 47.95,12.69 U$10.41 | U$10.84 47.95,10.18
  Top 0.813: 47.95,10.18 47.95,12.69
SWDIO
  Top 0.813: U$10.86 U$10.43
VBUS
  Top 0.813: U$10.40 U$10.64

### Text on the board
tPlace: SPI0,UART,I2C | POWER | ANALOG | Designed in Aizu | #526 | Rev.2.0.3 | I/O | VCC | 12 | 13 | 14 | 15 | G P | RESET | BAT | Raspberry Pi Pico | GPIO | SWCLK | GND | SWDIO | 9V
bPlace: GP0 | VBUS | GP1 | VSYS | GND | GND | 2 | GP2 | 3V3EN | 1 | GP3 | 3V3OUT | GP4 | VREF | GP5 | GP28 | GND | GND | GP6 | GP27 | GP7 | GP26 | GP8 | RUN | GP9 | GP22 | S/N | GND | GND | GP10 | GP21 | GP11 | GP20 | GP12 | GP19 | GP13 | GP18 | GND | GND | GP14 | GP17 | GP15 | GP16 | 1 | 2
Document: SPI0 | UART0 | I2C1 | ANALOG | UART2 | GP2,3,6 | GP7,10,11 | 6V~9V | GP20,21,22 | Rapbserry Pi Pico / AI Blocks Full SIZE Rev2.0.3 / 2023/02/02